# EAGLE board P1001-001-003-320 - Controller (EAGLE 9.4.2), part 1 of 3
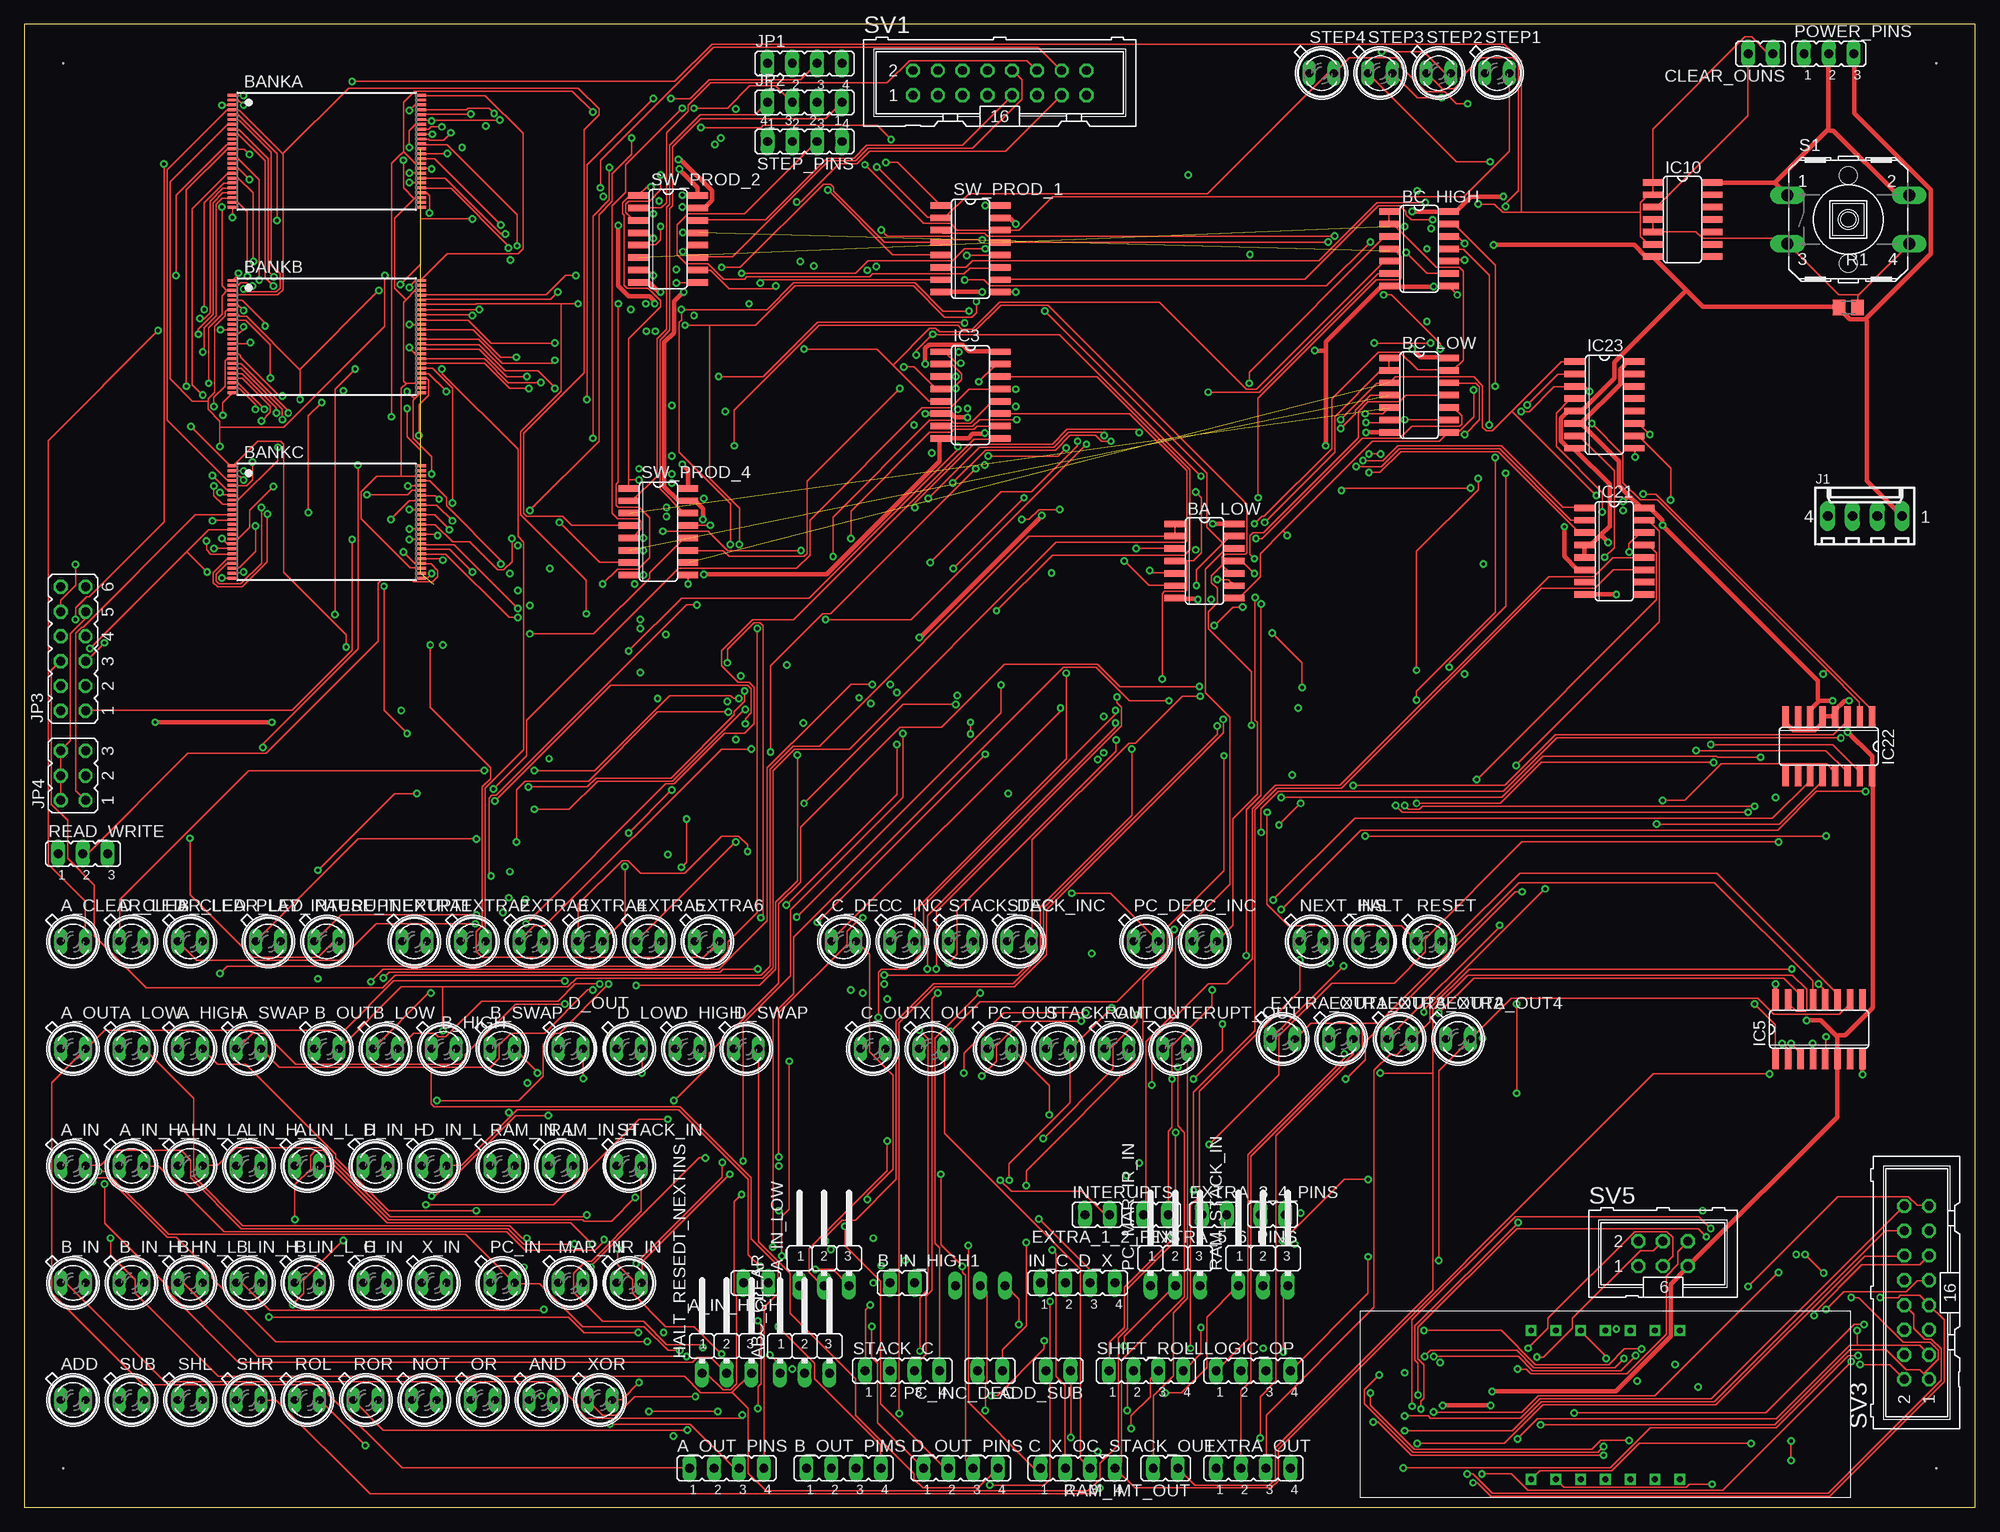
[diagram p5: board, top side]
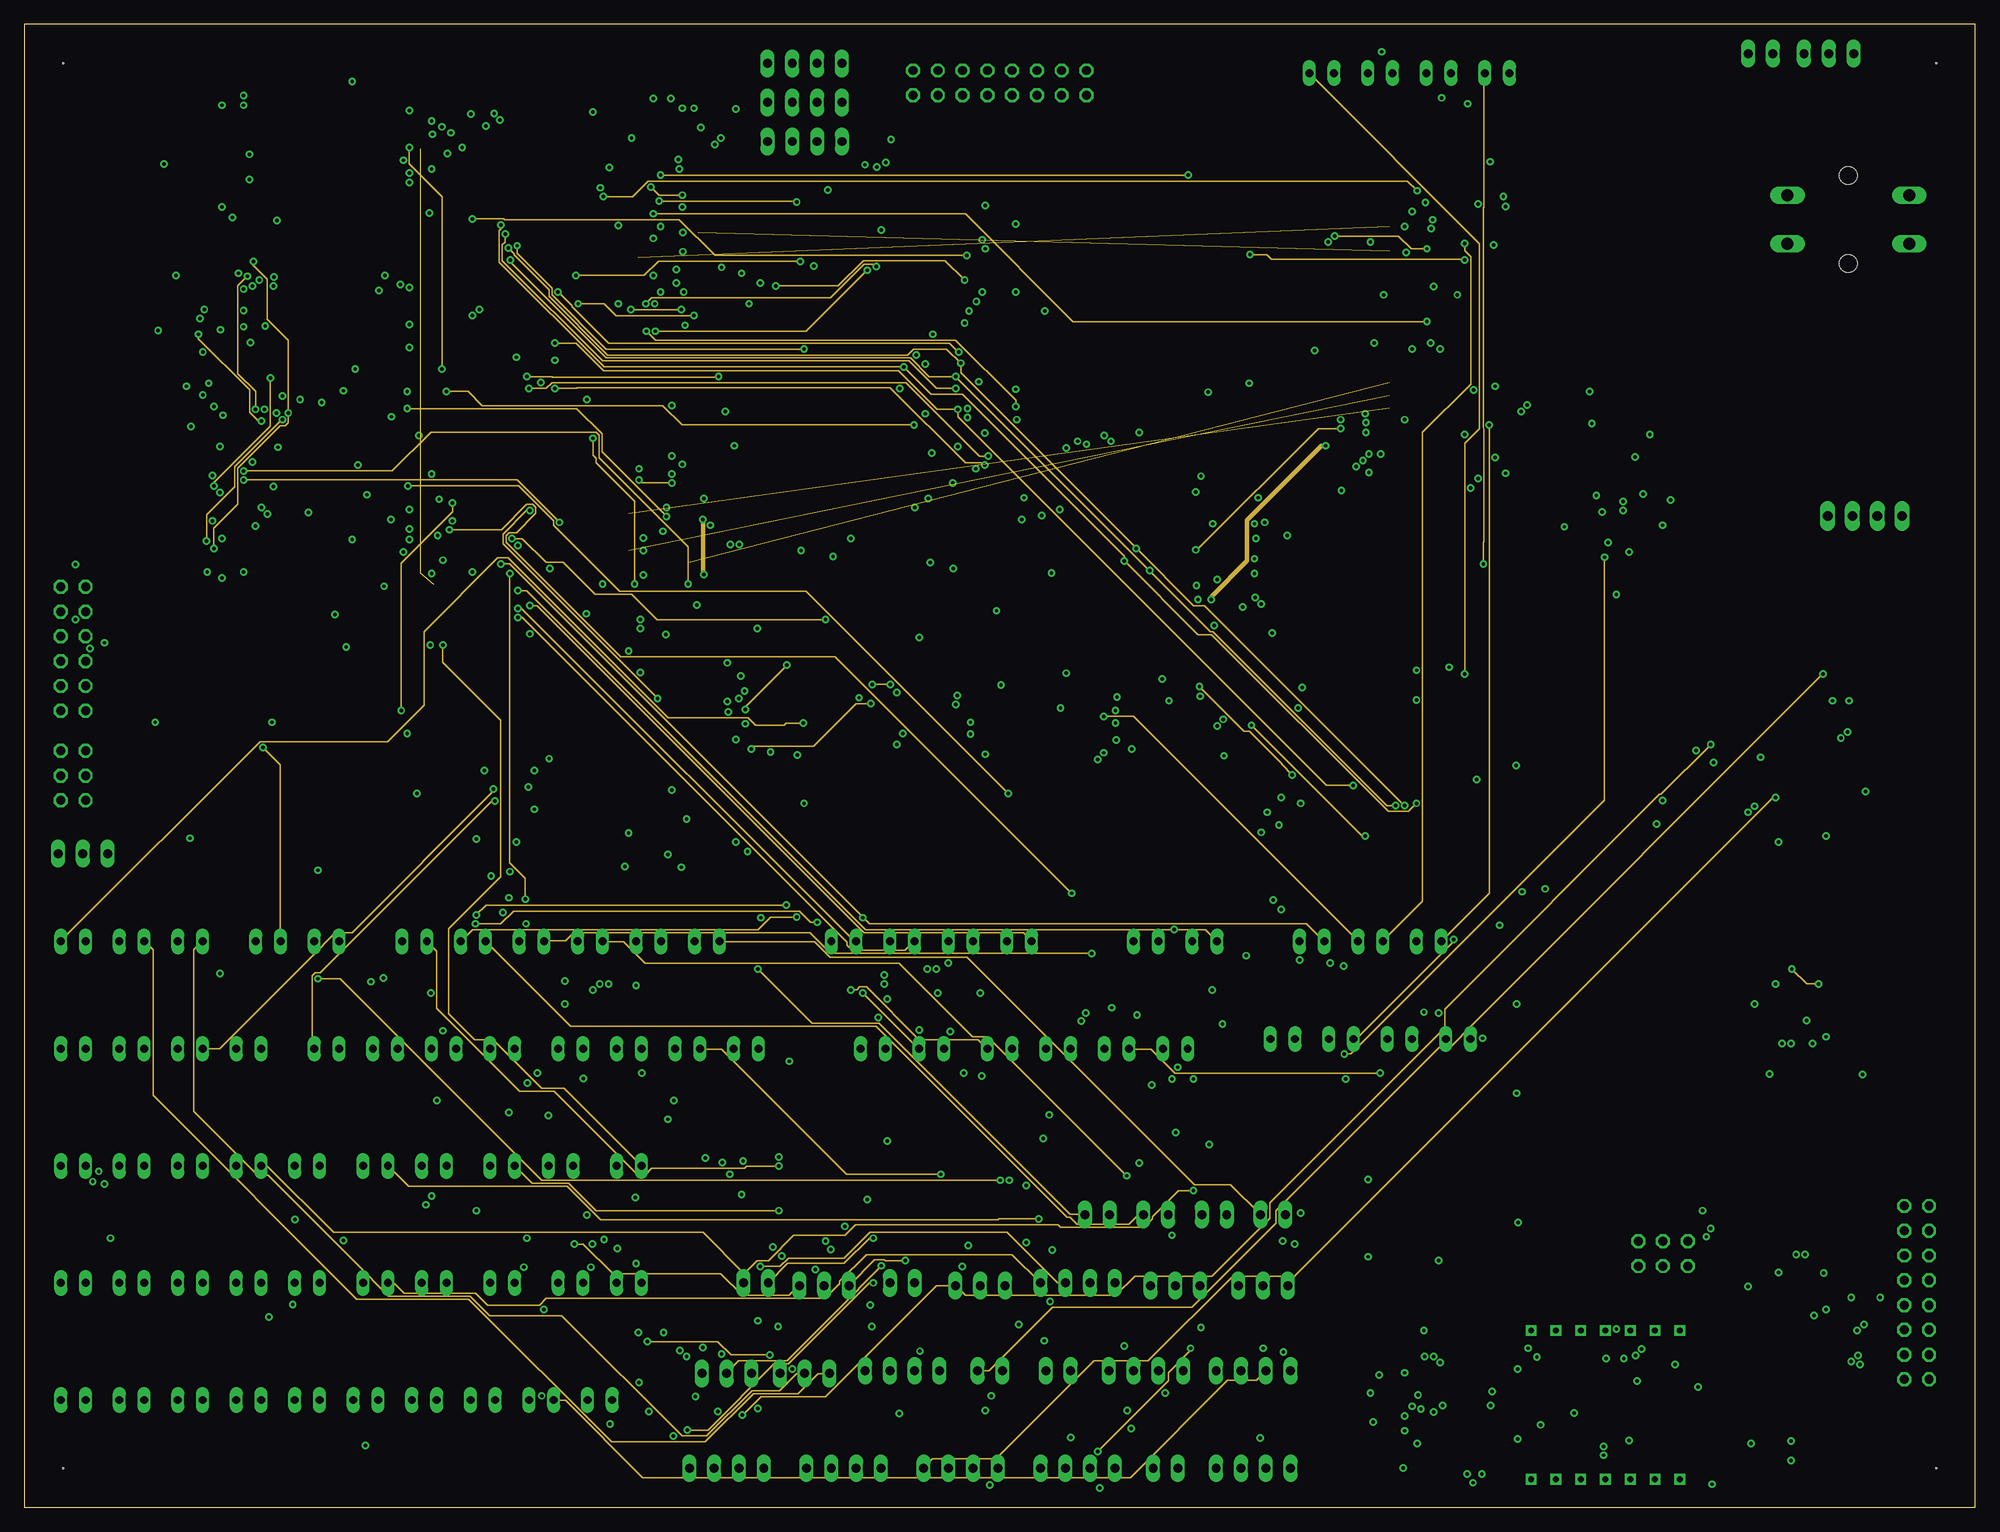
[diagram p6: board, inner layer Route2]
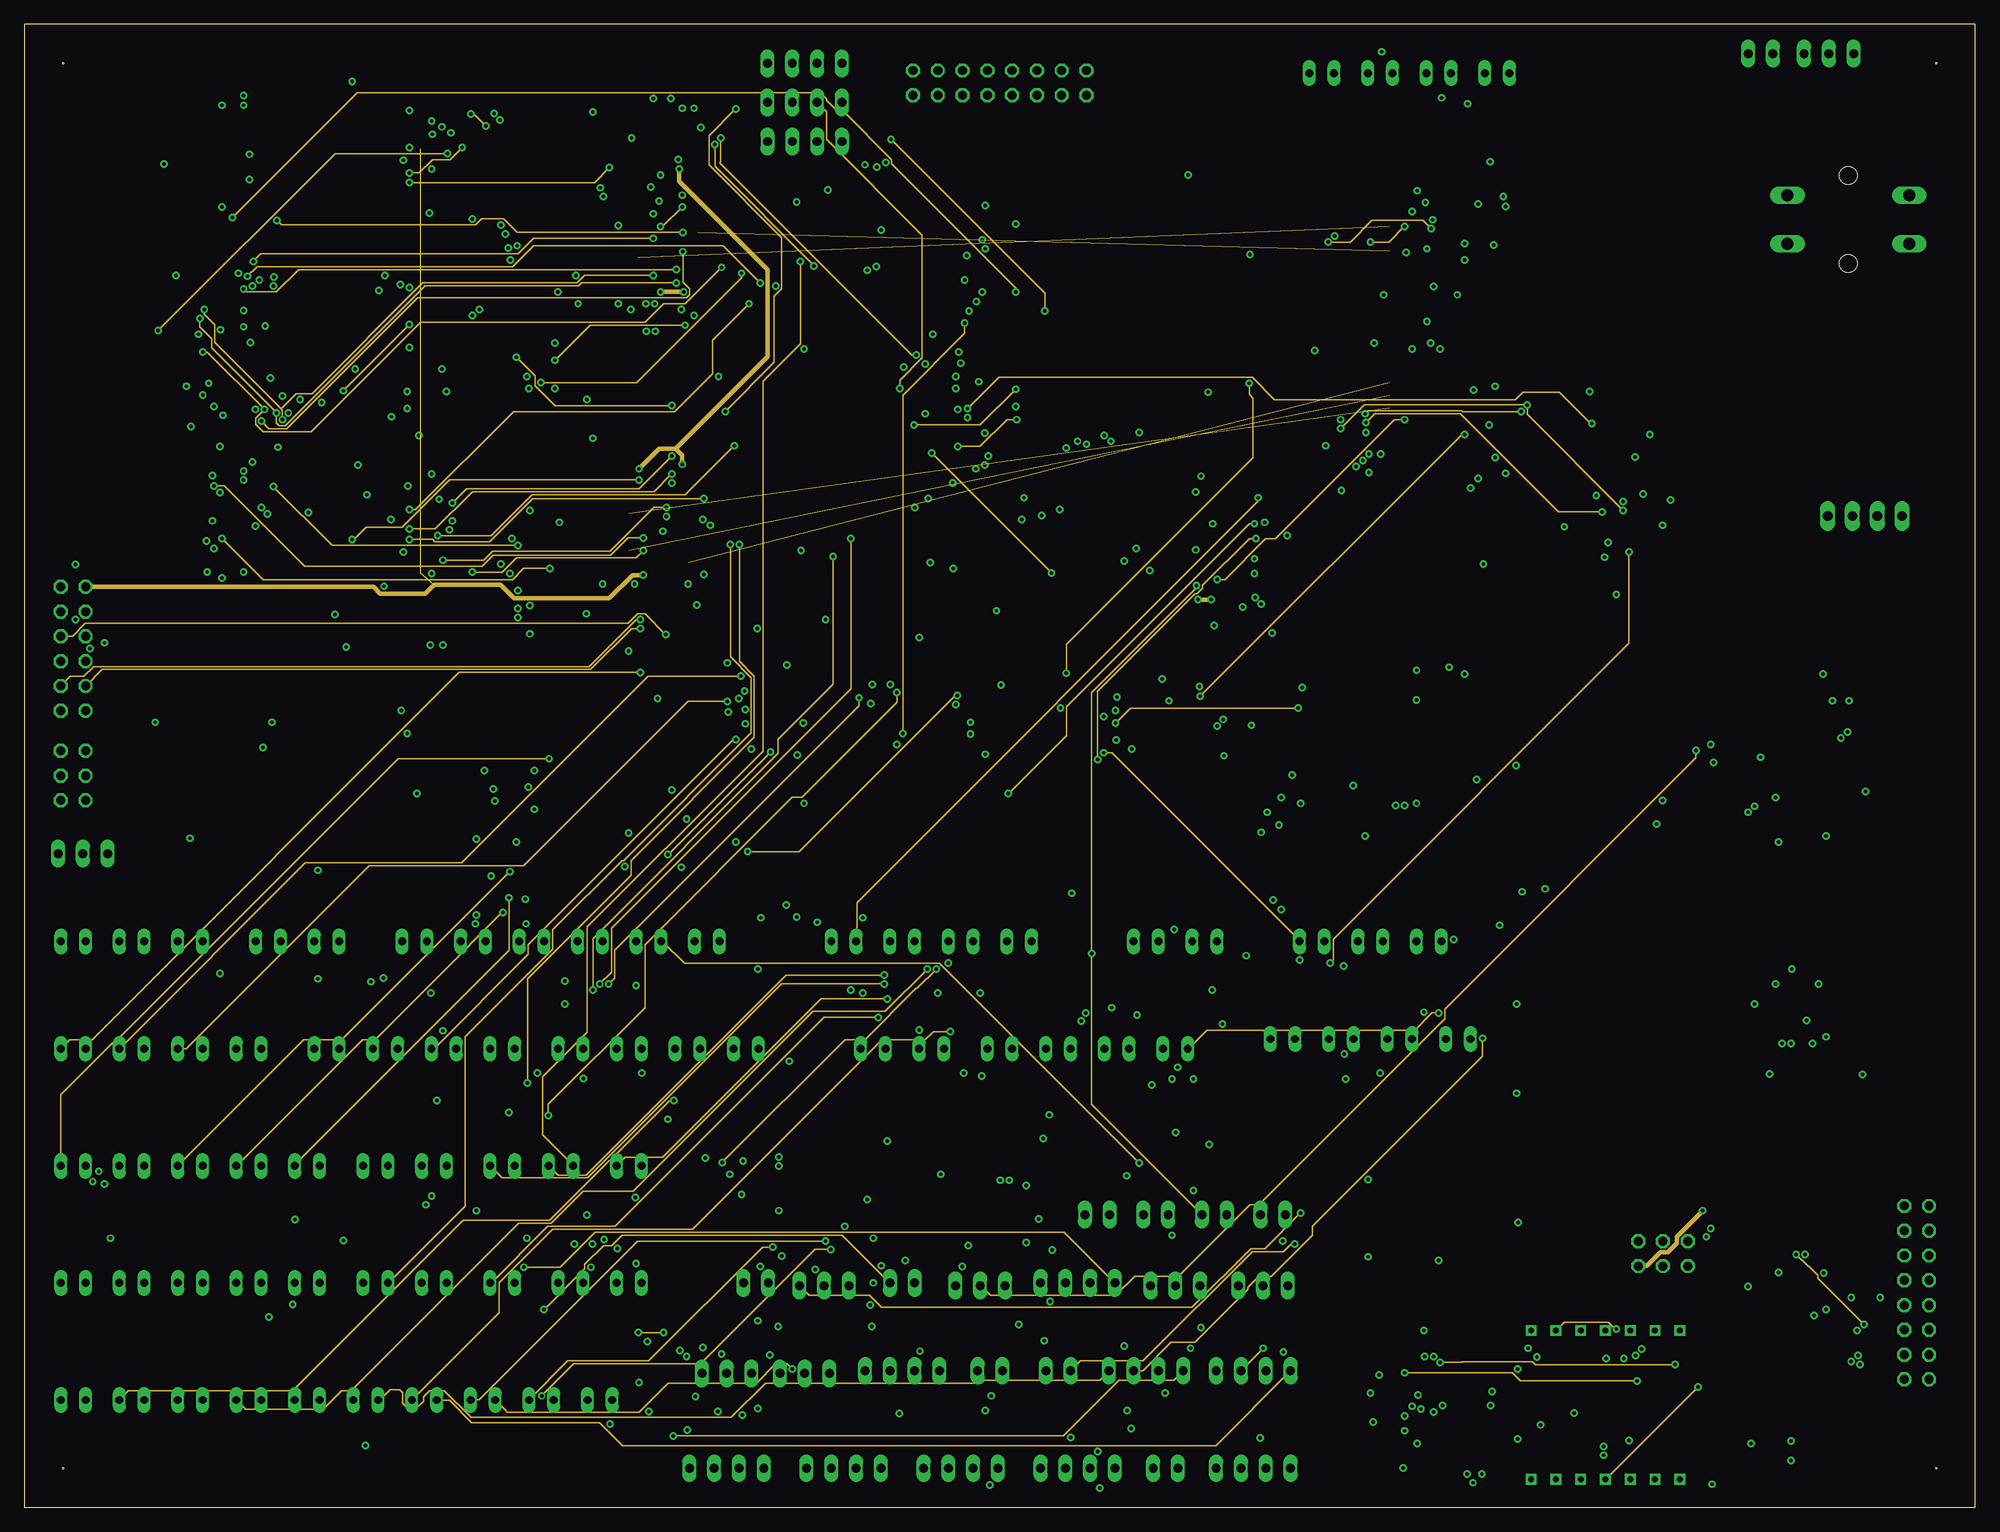
[diagram p7: board, inner layer Route15]
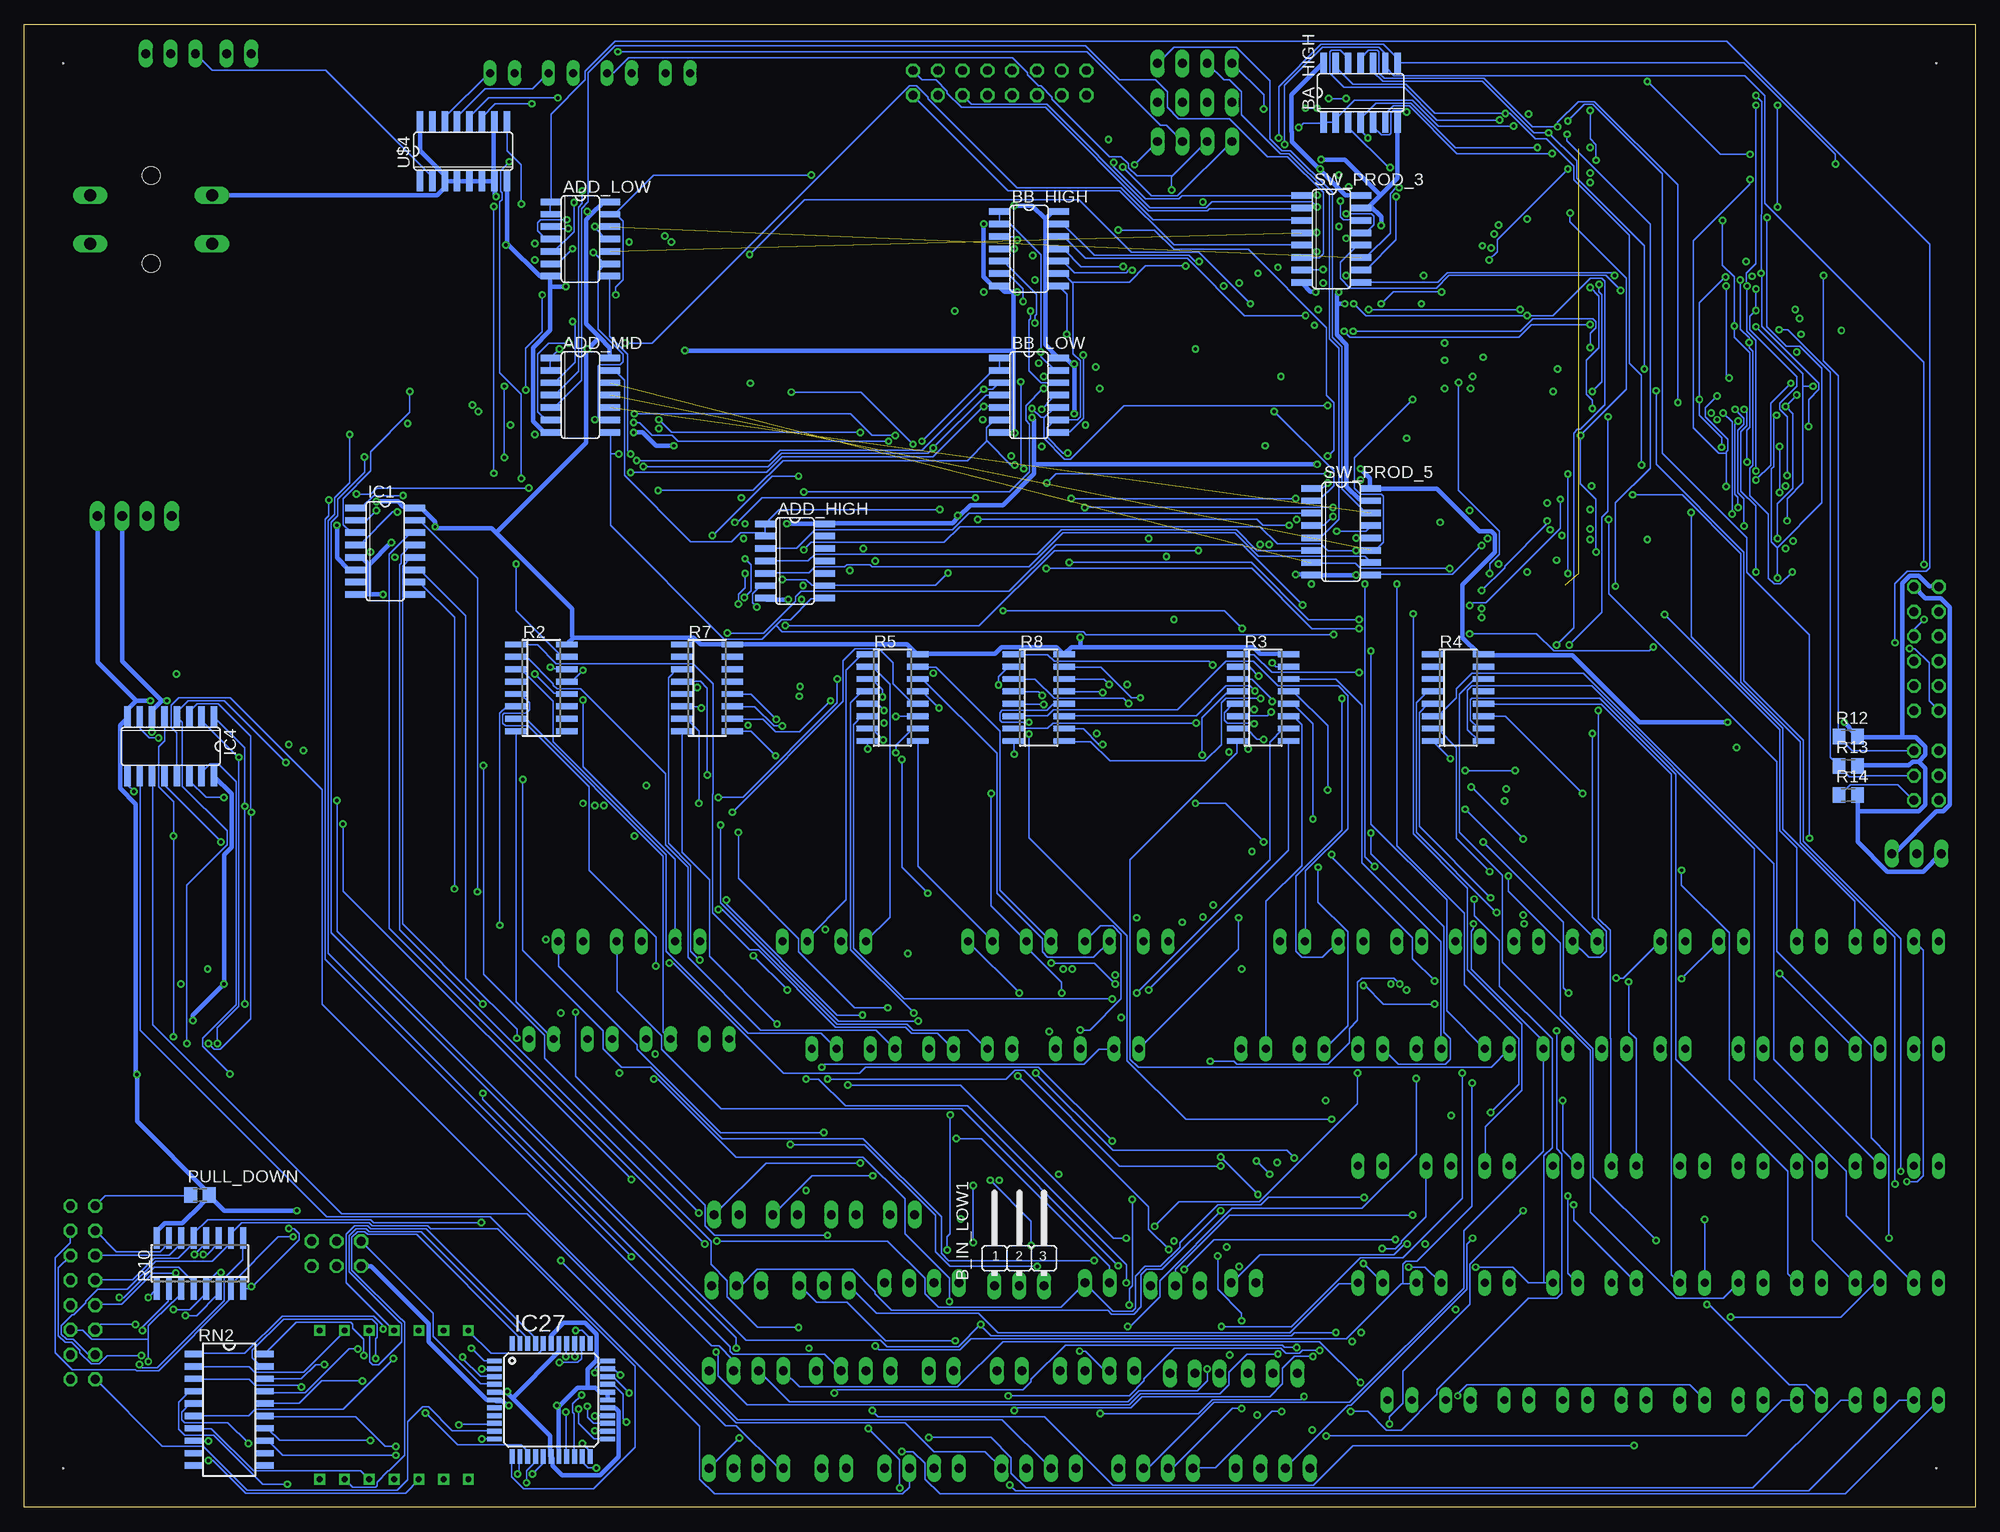
[diagram p8: board, bottom side, seen from below]

Size 200 x 152 mm. Coordinates in mm from the lower left corner, seen from the top.
Outline: 0,0 200,0 200,152 0,152 0,0
Copper layers (1+2*15+16): Top 0.035mm / dielectric 1.5mm / Route2 0.035mm / dielectric 0.15mm / Route15 0.035mm / dielectric 0.2mm / Bottom 0.035mm
Design rules "default *": minimum track width 6mil, minimum drill 0.35mm, track to track 6mil, track to pad 6mil, pad to pad 6mil, via to via 6mil, smd to smd 6mil, copper to edge 40mil, drill to drill 6mil, minimum pad ring 10mil, minimum via ring 8mil, stop-mask expansion 4mil, vias tented up to drill 0mil, thermal gap 10mil
Net classes: 1 power: width 0.457 mm
Holes 0.12 mm at 4,4 196,148 4,148 196,4

## Footprints (pad centres in the part's own frame; a part is rotated, then mirrored left to right if it is on the bottom)
SFH482 = drill 0.813 long: A -1.27,0; K 1.27,0
JP1 = drill 0.914 long: 1 0,-1.27; 2 0,1.27
JP2W = drill 0.914 long: 1 -2.54,-1.27; 2 0,-1.27; 3 2.54,-1.27
JP4 = drill 0.914 long: 1 -3.81,0; 2 -1.27,0; 3 1.27,0; 4 3.81,0
SO14 = smd 0.66 x 2.032: 1 -3.81,-3.073; 2 -2.54,-3.073; 3 -1.27,-3.073; 4 0,-3.073; 5 1.27,-3.073; 6 2.54,-3.073; 7 3.81,-3.073; 8 3.81,3.073; 9 2.54,3.073; 10 1.27,3.073; 11 0,3.073; 12 -1.27,3.073; 13 -2.54,3.073; 14 -3.81,3.073
TSOP48 = smd 1.1 x 0.3: 1 -9.625,5.75; 2 -9.625,5.25; 3 -9.625,4.75; 4 -9.625,4.25; 5 -9.625,3.75; 6 -9.625,3.25; 7 -9.625,2.75; 8 -9.625,2.25; 9 -9.625,1.75; 10 -9.625,1.25; 11 -9.625,0.75; 12 -9.625,0.25; 13 -9.625,-0.25; 14 -9.625,-0.75; 15 -9.625,-1.25; 16 -9.625,-1.75; 17 -9.625,-2.25; 18 -9.625,-2.75; 19 -9.625,-3.25; 20 -9.625,-3.75; 21 -9.625,-4.25; 22 -9.625,-4.75; 23 -9.625,-5.25; 24 -9.625,-5.75; 25 9.625,-5.75; 26 9.625,-5.25; 27 9.625,-4.75; 28 9.625,-4.25; 29 9.625,-3.75; 30 9.625,-3.25; 31 9.625,-2.75; 32 9.625,-2.25; 33 9.625,-1.75; 34 9.625,-1.25; 35 9.625,-0.75; 36 9.625,-0.25; 37 9.625,0.25; 38 9.625,0.75; 39 9.625,1.25; 40 9.625,1.75; 41 9.625,2.25; 42 9.625,2.75; 43 9.625,3.25; 44 9.625,3.75; 45 9.625,4.25; 46 9.625,4.75; 47 9.625,5.25; 48 9.625,5.75
SO16 = smd 0.66 x 2.032: 1 -4.445,-3.073; 2 -3.175,-3.073; 3 -1.905,-3.073; 4 -0.635,-3.073; 5 0.635,-3.073; 6 1.905,-3.073; 7 3.175,-3.073; 8 4.445,-3.073; 9 4.445,3.073; 10 3.175,3.073; 11 1.905,3.073; 12 0.635,3.073; 13 -0.635,3.073; 14 -1.905,3.073; 15 -3.175,3.073; 16 -4.445,3.073
TQFP44 = smd 1.5 x 0.5: 1 -5.8,4; 2 -5.8,3.2; 3 -5.8,2.4; 4 -5.8,1.6; 5 -5.8,0.8; 6 -5.8,0; 7 -5.8,-0.8; 8 -5.8,-1.6; 9 -5.8,-2.4; 10 -5.8,-3.2; 11 -5.8,-4; 23 5.8,-4; 24 5.8,-3.2; 25 5.8,-2.4; 26 5.8,-1.6; 27 5.8,-0.8; 28 5.8,0; 29 5.8,0.8; 30 5.8,1.6; 31 5.8,2.4; 32 5.8,3.2; 33 5.8,4 | smd 0.5 x 1.5: 12 -4,-5.8; 13 -3.2,-5.8; 14 -2.4,-5.8; 15 -1.6,-5.8; 16 -0.8,-5.8; 17 0,-5.8; 18 0.8,-5.8; 19 1.6,-5.8; 20 2.4,-5.8; 21 3.2,-5.8; 22 4,-5.8; 34 4,5.8; 35 3.2,5.8; 36 2.4,5.8; 37 1.6,5.8; 38 0.8,5.8; 39 0,5.8; 40 -0.8,5.8; 41 -1.6,5.8; 42 -2.4,5.8; 43 -3.2,5.8; 44 -4,5.8
6410-04 = drill 1.016 long: 1 3.81,0; 2 1.27,0; 3 -1.27,0; 4 -3.81,0
JP6Q = drill 0.914 octagon: 1 -6.35,-1.27; 2 -6.35,1.27; 3 -3.81,-1.27; 4 -3.81,1.27; 5 -1.27,-1.27; 6 -1.27,1.27; 7 1.27,-1.27; 8 1.27,1.27; 9 3.81,-1.27; 10 3.81,1.27; 11 6.35,-1.27; 12 6.35,1.27
JP3Q = drill 0.914 octagon: 1 -2.54,-1.27; 2 -2.54,1.27; 3 0,-1.27; 4 0,1.27; 5 2.54,-1.27; 6 2.54,1.27
JP2 = drill 0.914 long: 1 -2.54,0; 2 0,0; 3 2.54,0
M0805 = smd 1.3 x 1.6: 1 -0.95,0; 2 0.95,0
SO16' = smd 0.6 x 2.2: 1 -4.445,-2.6; 2 -3.175,-2.6; 3 -1.905,-2.6; 4 -0.635,-2.6; 5 0.635,-2.6; 6 1.905,-2.6; 7 3.175,-2.6; 8 4.445,-2.6; 9 4.445,2.6; 10 3.175,2.6; 11 1.905,2.6; 12 0.635,2.6; 13 -0.635,2.6; 14 -1.905,2.6; 15 -3.175,2.6; 16 -4.445,2.6
SOMC20 = smd 1.91 x 0.64: 1 -3.62,5.715; 2 -3.62,4.445; 3 -3.62,3.175; 4 -3.62,1.905; 5 -3.62,0.635; 6 -3.62,-0.635; 7 -3.62,-1.905; 8 -3.62,-3.175; 9 -3.62,-4.445; 10 -3.62,-5.715; 11 3.62,-5.715; 12 3.62,-4.445; 13 3.62,-3.175; 14 3.62,-1.905; 15 3.62,-0.635; 16 3.62,0.635; 17 3.62,1.905; 18 3.62,3.175; 19 3.62,4.445; 20 3.62,5.715
B3F-40XX = drill 1.194 long: 1 -6.248,2.489; 2 6.248,2.489; 3 -6.248,-2.489; 4 6.248,-2.489 | hole 1.803: 0,-4.496; 0,4.496
ML16 = drill 0.914 octagon: 1 -8.89,-1.27; 2 -8.89,1.27; 3 -6.35,-1.27; 4 -6.35,1.27; 5 -3.81,-1.27; 6 -3.81,1.27; 7 -1.27,-1.27; 8 -1.27,1.27; 9 1.27,-1.27; 10 1.27,1.27; 11 3.81,-1.27; 12 3.81,1.27; 13 6.35,-1.27; 14 6.35,1.27; 15 8.89,-1.27; 16 8.89,1.27
ML6 = drill 0.914 octagon: 1 -2.54,-1.27; 2 -2.54,1.27; 3 0,-1.27; 4 0,1.27; 5 2.54,-1.27; 6 2.54,1.27
4-DIGIT-7-SEGMENT = drill 0.6 square: PIN1 17.48,1.88; PIN2 20.02,1.88; PIN3 22.56,1.88; PIN4 25.1,1.88; PIN5 27.64,1.88; PIN6 30.18,1.88; PIN7 32.72,1.88; PIN8 32.72,17.12; PIN9 30.18,17.12; PIN10 27.64,17.12; PIN11 25.1,17.12; PIN12 22.56,17.12; PIN13 20.02,17.12; PIN14 17.48,17.12

## Placement (x,y rotation side)
A_CLEAR_LED  [SFH482]  5,58 0 top
A_HIGH  [SFH482]  17,47 0 top
A_IN  [SFH482]  5,35 0 top
A_IN_H_H  [SFH482]  11,35 0 top
A_IN_H_L  [SFH482]  23,35 0 top
A_IN_HIGH  [JP1]  75,23 90 top
A_IN_L_H  [SFH482]  29,35 0 top
A_IN_L_L  [SFH482]  17,35 0 top
A_IN_LOW  [JP2W]  82,24 0 top
A_LOW  [SFH482]  11,47 0 top
A_OUT  [SFH482]  5,47 0 top
A_OUT_PINS  [JP4]  72,4 0 top
A_SWAP  [SFH482]  23,47 0 top
ABC_CLEAR  [JP2W]  80,15 0 top
ADD  [SFH482]  5,11 0 top
ADD_HIGH  74ABT164D  [SO14]  121,97 270 bottom
ADD_LOW  74ABT164D  [SO14]  143,130 270 bottom
ADD_MID  74ABT164D  [SO14]  143,114 270 bottom
ADD_SUB  [JP1]  106,14 90 top
AND  [SFH482]  53,11 0 top
B_CLEAR_LED  [SFH482]  17,58 0 top
B_HIGH  [SFH482]  43,47 0 top
B_IN  [SFH482]  5,23 0 top
B_IN_H_H  [SFH482]  11,23 0 top
B_IN_H_L  [SFH482]  23,23 0 top
B_IN_HIGH1  [JP1]  90,23 270 top
B_IN_L_H  [SFH482]  29,23 0 top
B_IN_L_L  [SFH482]  17,23 0 top
B_IN_LOW1  [JP2W]  98,24 0 bottom
B_LOW  [SFH482]  37,47 0 top
B_OUT  [SFH482]  31,47 0 top
B_OUT_PIMS  [JP4]  84,4 0 top
B_SWAP  [SFH482]  49,47 0 top
BA_HIGH  74ABT164D  [SO14]  63,145 0 bottom
BA_LOW  74ABT164D  [SO14]  121,97 270 top
BANKA  SST39VF1602-70-4I-EKE  [TSOP48]  31,139 0 top
BANKB  SST39VF1602-70-4I-EKE  [TSOP48]  31,120 0 top
BANKC  SST39VF1602-70-4I-EKE  [TSOP48]  31,101 0 top
BB_HIGH  74ABT164D  [SO14]  97,129 270 bottom
BB_LOW  74ABT164D  [SO14]  97,114 270 bottom
BC_HIGH  74ABT164D  [SO14]  143,129 270 top
BC_LOW  74ABT164D  [SO14]  143,114 270 top
C_DEC  [SFH482]  84,58 0 top
C_IN  [SFH482]  36,23 0 top
C_INC  [SFH482]  90,58 0 top
C_OUT  [SFH482]  87,47 0 top
C_X_OC_STACK_OUT  [JP4]  108,4 0 top
CLEAR_OUNS  [JP1]  178,149 90 top
D_CLEAR_LED  [SFH482]  11,58 0 top
D_HIGH  [SFH482]  68,47 0 top
D_IN_H  [SFH482]  36,35 0 top
D_IN_L  [SFH482]  42,35 0 top
D_LOW  [SFH482]  62,47 0 top
D_OUT  [SFH482]  56,47 0 top
D_OUT_PINS  [JP4]  96,4 0 top
D_SWAP  [SFH482]  74,47 0 top
EXTRA1  [SFH482]  40,58 0 top
EXTRA2  [SFH482]  46,58 0 top
EXTRA3  [SFH482]  52,58 0 top
EXTRA4  [SFH482]  58,58 0 top
EXTRA5  [SFH482]  64,58 0 top
EXTRA6  [SFH482]  70,58 0 top
EXTRA_1_2_PINS  [JP1]  116,30 90 top
EXTRA_3_4_PINS  [JP1]  122,30 270 top
EXTRA_5_6_PINS  [JP1]  128,30 90 top
EXTRA_OUT  [JP4]  126,4 0 top
EXTRA_OUT1  [SFH482]  129,48 0 top
EXTRA_OUT2  [SFH482]  141,48 0 top
EXTRA_OUT3  [SFH482]  135,48 0 top
EXTRA_OUT4  [SFH482]  147,48 0 top
HALT  [SFH482]  138,58 0 top
HALT_RESEDT_NEXTINS  [JP2W]  72,15 0 top
IC1  74LS138D  [SO16]  163,98 270 bottom
IC3  74LS138D  [SO16]  97,114 270 top
IC4  74LS138D  [SO16]  185,78 180 bottom
IC5  74LS138D  [SO16]  184,49 0 top
IC10  74ALS00D  [SO14]  170,132 270 top
IC21  74LS138D  [SO16]  163,98 270 top
IC22  74LS138D  [SO16]  185,78 180 top
IC23  74LS138D  [SO16]  162,113 270 top
IC27  MEGA8535-A  [TQFP44]  146,11 0 bottom
IN_C_D_X  [JP4]  108,23 0 top
INTERUPT_OUT  [SFH482]  118,47 0 top
INTERUPTS  [JP1]  110,30 270 top
IR_IN  [SFH482]  62,23 0 top
J1  22-27-2041-04  [6410-04]  188.7,101.61 0 top
JP1  [JP4]  80,148 0 top
JP2  [JP4]  80,144 0 top
JP3  [JP6Q]  5,88 90 top
JP4  [JP3Q]  5,75 90 top
LOGIC_OP  [JP4]  126,14 0 top
MAR_IN  [SFH482]  56,23 0 top
NEXT_INS  [SFH482]  132,58 0 top
NOT  [SFH482]  41,11 0 top
OR  [SFH482]  47,11 0 top
PAUSE_INERUPT  [SFH482]  31,58 0 top
PC_DEC  [SFH482]  115,58 0 top
PC_IN  [SFH482]  49,23 0 top
PC_INC  [SFH482]  121,58 0 top
PC_INC_DEC  [JP1]  99,14 90 top
PC_MAR_IR_IN  [JP2W]  118,24 0 top
PC_OUT  [SFH482]  100,47 0 top
PLAY_INTERUPT  [SFH482]  25,58 0 top
POWER_PINS  [JP2]  185,149 0 top
PULL_DOWN  [M0805]  182,32 0 bottom
R1  [M0805]  187,123 0 top
R2  [SO16']  147,84 270 bottom
R3  [SO16']  73,83 270 bottom
R4  [SO16']  53,83 270 bottom
R5  [SO16']  111,83 270 bottom
R7  [SO16']  130,84 270 bottom
R8  [SO16']  96,83 270 bottom
R10  [SO16']  182,25 0 bottom
R12  [M0805]  13,79 0 bottom
R13  [M0805]  13,76 0 bottom
R14  [M0805]  13,73 0 bottom
RAM_IMT_OUT  [JP1]  117,4 90 top
RAM_IN_H  [SFH482]  55,35 0 top
RAM_IN_L  [SFH482]  49,35 0 top
RAM_OUT  [SFH482]  112,47 0 top
RAM_STACK_IN  [JP2W]  127,24 0 top
READ_WRITE  [JP2]  6,67 0 top
RESET  [SFH482]  144,58 0 top
RN2  [SOMC20]  179,10 0 bottom
ROL  [SFH482]  29,11 0 top
ROR  [SFH482]  35,11 0 top
S1  [B3F-40XX]  187,132 0 top
SHIFT_ROLL  [JP4]  115,14 0 top
SHL  [SFH482]  17,11 0 top
SHR  [SFH482]  23,11 0 top
STACK_C  [JP4]  90,14 0 top
STACK_DEC  [SFH482]  96,58 0 top
STACK_IN  [SFH482]  62,35 0 top
STACK_INC  [SFH482]  102,58 0 top
STACK_OUT  [SFH482]  106,47 0 top
STEP1  [SFH482]  151,147 0 top
STEP2  [SFH482]  145,147 0 top
STEP3  [SFH482]  139,147 0 top
STEP4  [SFH482]  133,147 0 top
STEP_PINS  [JP4]  80,140 180 top
SUB  [SFH482]  11,11 0 top
SV1  [ML16]  100,146 0 top
SV3  [ML16]  194,22 90 top
SV5  [ML6]  168,26 0 top
SW_PROD_1  74LS157D  [SO16]  97,129 270 top
SW_PROD_2  74LS157D  [SO16]  66,130 270 top
SW_PROD_3  74LS157D  [SO16]  66,130 270 bottom
SW_PROD_4  74LS157D  [SO16]  65,100 270 top
SW_PROD_5  74LS157D  [SO16]  65,100 270 bottom
U$1  4-DIGIT-7-SEGMENT  [4-DIGIT-7-SEGMENT]  137,1 0 top
U$4  SN74HC161  [SO16]  155,139 0 bottom
X_IN  [SFH482]  42,23 0 top
X_OUT  [SFH482]  93,47 0 top
XOR  [SFH482]  59,11 0 top

## Tracks (layer width: path | path; a pad name or v marks a point on that pad's centre or on a via)
!CLEAR  (via drill 0.35)
  Top 0.152: v19.28,101.12 19.36,101.19 21.34,101.19 BANKC.12 | v22.48,121.01 22.48,120.78 22.02,120.32 21.41,120.32 BANKB.12 | v16.61,114.91 16.61,135.03 20.8,139.22 21.34,139.22 BANKA.12 21.41,139.22 22.55,139.22 v23.09,138.68 | 165.66,132.74 165.66,133.73 166.42,134.49 166.88,134.49 IC10.2 166.95,134.57 166.95,135.79 IC10.1 166.95,135.87 166.95,141.28 176.4,150.72 177.09,150.72 178.76,149.05 179.22,149.05 CLEAR_OUNS.1 | 165.66,132.74 165.66,130.3 166.5,129.46 166.88,129.46 IC10.6 | v149.05,133.58 150.72,133.58 151.56,132.74 153.47,132.74 | 165.66,132.74 153.47,132.74 | v33.6,146.15 66.67,146.15 70.48,149.96 151.71,149.96 153.47,148.21 153.47,132.74
  Bottom 0.152: v19.28,101.12 19.28,103.4 17.68,105 17.68,114.91 | 17.68,114.91 17.68,116.2 v22.48,121.01 | 17.68,114.91 v16.61,114.91 | v149.05,133.58 149.05,137.62 150.5,139.06 150.5,142.04 U$4.9 | v23.09,138.68 26.14,138.68 v33.6,146.15
A  (via drill 0.35)
  Top 0.152: v144.47,15.47 153.16,15.47 154.61,14.02 163.68,14.02 v165.2,15.54
  Bottom 0.152: v144.47,15.47 144.47,16.76 IC27.37 | v165.2,15.54 165.2,17.22 166.34,18.36 166.34,18.75 166.57,18.97 172.14,18.97 175.34,15.77 RN2.20
ADDR_BUS0  (via drill 0.35)
  Top 0.152: BANKC.25 41.3,95.25 v41.76,95.71 | v41.76,105.92 41.76,107.67 39.85,109.58 39.85,113.46 40.01,113.61 | 40.01,113.61 40.62,114.22 BANKB.25 | 40.62,132.06 40.62,127.41 v38.56,125.35 | 40.62,132.06 40.62,133.2 BANKA.25 | 40.01,113.61 v39.24,114.38 | v96.62,128.32 100.05,128.32 SW_PROD_1.12 | 40.62,132.06 v45.95,132.06
  Route2 0.152: v96.62,128.32 70.79,128.32 67.13,131.98 49.23,131.98 49.15,132.06 v45.95,132.06
  Bottom 0.152: v41.76,105.92 v41.76,95.71 | v38.56,125.35 38.56,124.59 38.25,124.28 38.25,115.37 v39.24,114.38
ADDR_BUS1  (via drill 0.35)
  Top 0.152: v20.27,95.25 BANKC.24 | v20.34,111.94 20.34,113.23 21.34,114.22 BANKB.24 | v21.34,132.21 21.34,133.2 BANKA.24 | v101.65,124.59 100.13,124.59 SW_PROD_1.9
  Route15 0.152: v101.65,124.59 101.65,124.97 88.92,137.69 88.92,138.15 84.05,143.03 83.44,143.03 82.22,144.25 82.22,144.4 81.61,145.01 34.14,145.01 v21.34,132.21
  Bottom 0.152: 20.27,98.37 v20.27,95.25 | 20.27,98.37 20.88,98.98 20.88,106.45 20.65,106.68 20.65,111.63 v20.34,111.94 | v21.34,132.21 21.34,121.01 19.36,119.02 17.98,119.02 15.7,116.74 15.7,102.95 20.27,98.37
ADDR_BUS2  (via drill 0.35)
  Top 0.152: v22.48,95.86 22.4,95.78 21.41,95.78 BANKC.23 | v23.7,112.55 23.7,113 22.02,114.68 21.41,114.68 BANKB.23 | v22.86,126.19 22.86,132.82 21.95,133.73 21.41,133.73 BANKA.23 | v75.44,125.5 75.74,125.81 93.88,125.81 SW_PROD_1.7
  Route2 0.152: v22.86,126.19 21.87,125.2 21.87,116.2 23.7,114.38 v23.7,112.55
  Route15 0.152: v75.44,125.5 71.63,129.31 52.2,129.31 50.06,127.18 23.85,127.18 v22.86,126.19
  Bottom 0.152: v22.48,95.86 22.48,102.64 24,104.17 24,110.26 23.39,110.87 23.39,112.24 v23.7,112.55
ADDR_BUS3  (via drill 0.35)
  Top 0.152: v23.7,100.58 23.7,97.99 22.02,96.32 21.41,96.32 BANKC.22 | v24.61,112.55 21.95,115.21 21.41,115.21 BANKB.22 | v18.29,118.42 18.44,118.57 18.44,120.93 19.66,122.15 19.66,133.58 20.27,134.19 21.34,134.19 BANKA.22 | v71.48,127.1 73.38,127.1 81.92,135.64 82.68,135.64 82.98,135.33 82.98,134.87 88.16,129.69 93.88,129.69 SW_PROD_1.4
  Route15 0.152: v18.29,118.42 18.75,118.42 v24.61,112.55 23.7,111.63 23.7,111.02 24.46,110.26 29.41,110.26 40.62,121.46 63.63,121.46 65.53,123.37 67.74,123.37 v71.48,127.1
  Bottom 0.152: v23.7,100.58 23.7,103.4 24.31,104.01 24.31,110.41 23.7,111.02 23.7,111.63 v24.61,112.55
ADDR_BUS4  (via drill 0.35)
  Top 0.152: v24.31,102.49 24.31,96.77 22.17,94.64 19.96,94.64 19.66,94.94 19.66,95.63 20.73,96.7 21.34,96.7 BANKC.21 | v24.31,111.33 25.22,112.24 25.22,112.85 22.33,115.75 21.41,115.75 BANKB.21 | v17.83,120.24 17.83,120.78 19.36,122.3 19.36,133.73 20.34,134.72 21.34,134.72 BANKA.21 | v67.51,128.7 68.12,129.31 69.04,129.31 SW_PROD_2.12
  Route2 0.152: v17.83,120.24 17.83,119.79 23.09,114.53 23.09,112.24 24,111.33 v24.31,111.33
  Route15 0.152: v67.51,128.7 67.51,125.58 68.2,124.89 68.2,124.28 67.89,123.98 40.31,123.98 26.9,110.57 25.07,110.57 v24.31,111.33
  Bottom 0.152: v24.31,102.49 24.31,103.56 24.61,103.86 24.61,111.02 v24.31,111.33
ADDR_BUS5  (via drill 0.35)
  Top 0.152: v24.92,101.8 24.92,96.93 22.33,94.34 19.81,94.34 19.36,94.79 19.36,95.78 20.8,97.23 21.34,97.23 BANKC.20 | v25.83,112.17 25.83,112.7 22.33,116.2 21.41,116.2 BANKB.20 | v17.98,121.84 18.44,121.84 19.05,122.45 19.05,133.88 20.34,135.18 21.34,135.18 BANKA.20 | v66.83,125.5 69.04,125.5 SW_PROD_2.9
  Route15 0.152: v17.98,121.84 17.98,121.01 19.2,119.79 19.2,118.87 25.83,112.24 v25.83,112.17 25.83,111.18 26.14,110.87 26.75,110.87 41.07,125.2 56.84,125.2 57.15,125.5 v66.83,125.5
  Bottom 0.152: v24.92,101.8 24.92,111.25 v25.83,112.17
ADDR_BUS6  (via drill 0.35)
  Top 0.152: v18.67,99.06 18.67,98.15 19.13,97.69 21.34,97.69 BANKC.19 | v26.44,111.48 26.44,112.55 22.25,116.74 21.41,116.74 BANKB.19 | v18.44,122.76 18.44,133.73 20.42,135.71 21.34,135.71 BANKA.19 | v64.47,126.26 63.93,126.8 62.94,126.8 SW_PROD_2.7
  Route2 0.152: v18.67,99.06 18.67,101.73 21.57,104.62 21.57,106.68 26.36,111.48 v26.44,111.48
  Route15 0.152: v18.44,122.76 18.44,122.3 19.51,121.23 19.51,119.41 26.33,112.58 | 26.33,112.58 26.44,112.47 v26.44,111.48 | v64.47,126.26 57.45,126.26 56.69,125.5 40.84,125.5 29.49,114.15 27.89,114.15 26.33,112.58
ADDR_BUS7  (via drill 0.35)
  Top 0.152: v19.43,98.3 21.34,98.3 BANKC.18 | v27.05,112.17 27.05,112.39 22.25,117.2 21.41,117.2 BANKB.18 | v23.47,127.71 23.47,134.72 21.95,136.25 21.41,136.25 BANKA.18 | v64.47,130.07 63.93,130.61 62.94,130.61 SW_PROD_2.4
  Route2 0.152: v19.43,98.3 19.43,100.36 21.87,102.79 21.87,106.53 26.21,110.87 26.75,110.87 27.05,111.18 v27.05,112.17 27.05,119.63 24.92,121.77 24.92,125.88 23.47,127.33 v23.47,127.71
  Route15 0.152: v64.47,130.07 52.2,130.07 50.6,128.47 24.23,128.47 v23.47,127.71
ADDR_BUS8  (via drill 0.35)
  Top 0.152: v25.98,108.66 25.98,107.29 21.95,103.25 21.41,103.25 BANKC.8 | v28.27,113.54 28.27,116.59 28.23,116.62 | 28.23,116.62 22.78,122.07 22.1,122.07 21.95,122.22 21.41,122.22 BANKB.8 | v25.6,126.11 24.99,126.72 24.99,138.23 22.02,141.2 21.41,141.2 BANKA.8 | 28.23,116.62 v36.35,124.74
  Bottom 0.152: v25.98,108.66 25.98,109.65 28.27,111.94 v28.27,113.54 28.27,123.44 v25.6,126.11 | v36.35,124.74 37.87,126.26 53.95,126.26 55.24,124.97 64.08,124.97 65.08,125.96 65.08,127.64 63.4,129.31 62.94,129.31 SW_PROD_3.12
ADDR_BUS9  (via drill 0.35)
  Top 0.152: v20.04,104.01 20.27,103.78 21.34,103.78 BANKC.7 | 20.04,110.72 20.04,111.33 18.82,112.55 18.82,113.39 | 20.04,110.72 v20.04,108.74 | 18.82,113.39 18.82,113.61 19.51,114.3 19.51,121.08 20.57,122.15 20.57,122.53 20.73,122.68 21.34,122.68 BANKB.7 | 18.82,113.39 17.22,113.39 14.94,115.67 14.94,135.87 20.8,141.73 21.34,141.73 BANKA.7 | v36.96,126.26 36.96,121.08 26.59,110.72 20.04,110.72
  Bottom 0.152: v20.04,108.74 v20.04,104.01 | v36.96,126.26 37.26,126.57 54.1,126.57 55.09,125.58 62.87,125.58 SW_PROD_3.9
ADDR_BUS10  (via drill 0.35)
  Top 0.152: v19.28,105.77 20.73,104.32 21.34,104.32 BANKC.6 | v22.48,122.68 21.95,123.22 21.41,123.22 BANKB.6 | v22.48,124.89 22.78,124.59 25.83,124.59 26.21,124.97 26.21,126.42 25.3,127.33 25.3,138.91 22.02,142.19 21.41,142.19 BANKA.6
  Route15 0.152: v66.83,126.87 28.12,126.87 25.83,124.59 22.78,124.59 v22.48,124.89
  Bottom 0.152: v19.28,105.77 19.28,111.78 20.04,112.55 20.04,113.16 18.29,114.91 18.29,115.9 23.09,120.7 23.09,122.07 v22.48,122.68 v22.48,124.89 | v66.83,126.87 69.04,126.87 SW_PROD_3.7
ADDR_BUS11  (via drill 0.35)
  Top 0.152: v23.39,107.14 23.39,105.31 22.78,104.7 21.41,104.7 BANKC.5 | v24.69,121.08 24.69,121.39 22.33,123.75 21.41,123.75 BANKB.5 | v25.91,131.9 25.91,138.76 21.95,142.72 21.41,142.72 BANKA.5
  Route15 0.152: v67.51,130.68 50.52,130.68 49.15,132.06 46.86,132.06 46.25,131.44 26.36,131.44 v25.91,131.9
  Bottom 0.152: v23.39,107.14 23.39,110.41 23.09,110.72 23.09,118.34 24.69,119.94 v24.69,121.08 24.69,126.11 25.91,127.33 v25.91,131.9 | v67.51,130.68 69.04,130.68 SW_PROD_3.4
ADDR_BUS12
  Top 0.152: BANKC.4 21.34,105.31 20.73,105.31 14.63,111.4 14.63,137.08 20.73,143.18 21.34,143.18 BANKA.4 21.41,143.18 22.02,143.18 26.48,138.72 | 26.48,138.72 26.52,138.68 26.52,124.82 25.98,124.28 21.41,124.28 BANKB.4 | 26.48,138.72 33.22,145.47 56.77,145.47 58.9,143.33 58.9,142.72 57.38,141.2 57.38,116.28 51.21,110.11 51.21,101.88 51.51,101.58 55.17,101.58 56.08,100.66 61.87,100.66 SW_PROD_4.4
ADDR_BUS13  (via drill 0.35)
  Top 0.152: v22.48,105.31 22.1,105.69 21.41,105.69 BANKC.3 | v18.9,115.21 18.9,120.93 20.27,122.3 20.27,124.21 20.77,124.7 | 20.77,124.7 20.8,124.74 21.34,124.74 BANKB.3 | v20.27,143.71 21.34,143.71 BANKA.3 | v20.27,133.27 20.27,125.2 20.77,124.7 | v54.86,100.97 58.98,96.85 61.87,96.85 SW_PROD_4.7
  Route2 0.152: v54.86,100.97 50.52,105.31 v22.48,105.31
  Bottom 0.152: v22.48,105.31 20.95,106.83 20.95,113.16 v18.9,115.21 | v20.27,133.27 v20.27,143.71
ADDR_BUS14  (via drill 0.35)
  Top 0.152: v22.48,106.22 21.41,106.22 BANKC.2 | v23.39,125.2 23.09,125.2 22.78,125.5 22.17,125.5 21.95,125.27 21.41,125.27 BANKB.2 | v22.48,143.71 21.95,144.25 21.41,144.25 BANKA.2 | v68.05,94.64 68.05,95.56 SW_PROD_4.9
  Route2 0.152: v68.05,94.64 68.05,98.45 58.9,107.59 58.9,109.88 58.6,110.19 41.68,110.19 37.72,106.22 v22.48,106.22
  Bottom 0.152: v22.48,106.22 22.48,119.63 23.39,120.55 v23.39,125.2 23.47,125.27 23.47,126.49 22.48,127.48 v22.48,143.71
ADDR_BUS15  (via drill 0.35)
  Top 0.152: v17.07,110.8 21.11,106.76 21.34,106.76 BANKC.1 21.41,106.76 23.93,109.27 26.29,109.27 26.59,108.97 26.59,95.86 32.99,89.46 v32.99,88.16 | v21.95,126.49 21.95,126.34 21.41,125.81 BANKB.1 | v22.48,144.7 21.41,144.7 BANKA.1 | v51.82,89.53 58.37,89.53 64.08,95.25 64.08,95.78 67.67,99.36 68.05,99.36 SW_PROD_4.12
  Bottom 0.152: v17.07,110.8 17.07,113.54 16,114.61 16,115.21 21.87,121.08 21.87,126.42 v21.95,126.49 21.95,132.51 21.87,132.59 21.87,144.09 v22.48,144.7 | v51.82,89.53 44.96,89.53 43.2,87.78 33.38,87.78 v32.99,88.16
ADDR_BUS16  (via drill 0.35)
  Top 0.152: v39.24,112.62 39.24,109.73 40.62,108.36 BANKC.48 | v39.47,125.04 39.78,125.35 39.78,125.42 40.08,125.73 40.62,125.73 BANKB.48 40.69,125.81 43.36,128.47 50.6,128.47 51.13,129.01 51.13,140.82 47.24,144.7 40.69,144.7 BANKA.48
  Route2 0.152: v65.84,101.58 59.21,108.2 59.21,110.03 56.62,112.62 v39.24,112.62
  Bottom 0.152: v39.24,112.62 39.24,113.46 39.85,114.07 39.85,117.58 38.56,118.87 38.56,124.13 v39.47,125.04 | v65.84,101.58 66.75,100.66 68.05,100.66 SW_PROD_5.4
ADDR_BUS17  (via drill 0.35)
  Top 0.152: v20.27,99.29 20.8,98.75 21.34,98.75 BANKC.17 | v19.43,112.85 19.43,113.77 20.57,114.91 20.57,117.5 20.8,117.73 21.34,117.73 BANKB.17 | v18.29,114 17.22,115.06 17.22,133.12 20.8,136.7 21.34,136.7 BANKA.17
  Route15 0.152: v53.87,96.24 51.21,96.24 50.06,95.1 24.46,95.1 v20.27,99.29
  Bottom 0.152: v20.27,99.29 20.27,102.87 18.67,104.47 18.67,112.09 v19.43,112.85 v18.29,114 | v53.87,96.24 63.02,96.24 63.55,96.77 68.05,96.77 SW_PROD_5.7
ADDR_BUS18  (via drill 0.35)
  Top 0.152: v25.53,104.62 23.09,102.18 23.09,100.43 21.95,99.29 21.41,99.29 BANKC.16 | v26.44,113.92 26.14,113.92 22.17,117.88 22.17,118.03 22.02,118.19 21.41,118.19 BANKB.16 | v23.09,136.09 21.95,137.24 21.41,137.24 BANKA.16
  Route15 0.152: v50.6,98.6 31.55,98.6 v25.53,104.62
  Bottom 0.152: 25.53,108.05 25.53,108.2 25.38,108.36 25.38,109.5 27.66,111.78 27.66,112.7 v26.44,113.92 | 25.53,108.05 v25.53,104.62 | v23.09,136.09 23.09,135.64 28.88,129.84 28.88,110.64 26.29,108.05 25.53,108.05 | v50.6,98.6 53.57,95.63 61.87,95.63 SW_PROD_5.9
ADDR_BUS19  (via drill 0.35)
  Top 0.152: v19.43,104.7 19.43,103.71 20.34,102.79 21.34,102.79 BANKC.9 | v25.22,115.75 25.22,119.18 22.71,121.69 21.41,121.69 BANKB.9 | v25.53,125.2 24.69,126.03 24.69,138 21.95,140.74 21.41,140.74 BANKA.9
  Route2 0.152: v19.43,104.7 19.43,105 25.22,110.8 v25.22,115.75
  Route15 0.152: v63.48,99.36 61.87,99.36 60.12,97.61 48.08,97.61 46.94,96.47 28.73,96.47 20.5,104.7 v19.43,104.7
  Bottom 0.152: v25.53,125.2 25.53,116.05 v25.22,115.75 | v63.48,99.36 61.95,99.36 SW_PROD_5.12
ADDR_SHIFT  (via drill 0.35)
  Top 0.152: v8.23,88.62 6.33,86.72 JP3.5
  Bottom 0.152: ADD_LOW.2 146.07,132.59 ADD_LOW.1 146,133.88 146,142.8 142.49,146.3 142.49,147.22 139.45,150.27 25.45,150.27 4.65,129.46 4.65,96.32 5.03,95.94 6.93,95.94 8.23,94.64 v8.23,88.62
B  (via drill 0.35)
  Top 0.152: v143.56,15.47 144.17,16.08 153.01,16.08 154.76,14.33 163.07,14.33 v163.98,15.24
  Bottom 0.152: v143.56,15.47 143.56,16.76 IC27.36 | v163.98,15.24 163.98,17.3 163.83,17.45 163.83,18.75 164.36,19.28 173.43,19.28 176.63,16.08 176.63,15.32 175.79,14.48 175.41,14.48 RN2.19
BANKA_PROG  (via drill 0.35)
  Top 0.152: v15.54,126.26 15.54,134.49 20.73,139.68 21.34,139.68 BANKA.11
  Bottom 0.152: v15.54,126.26 15.54,117.5 14.02,115.98 14.02,79.02 R12.1 13.95,78.94 12.57,77.57 6.33,77.57 JP4.5
BANKB_PROG  (via drill 0.35)
  Top 0.152: v20.12,120.7 21.34,120.7 BANKB.11
  Bottom 0.152: v20.12,120.7 19.2,120.7 14.86,116.36 14.86,76.89 14.02,76.05 R13.1 13.95,75.97 12.88,74.91 11.35,74.91 11.28,74.98 6.33,74.98 JP4.3
BANKC_PROG
  Top 0.152: BANKC.11 21.34,101.73 17.53,101.73 6.02,90.22 5.87,90.22 5.26,89.61 5.26,73.46 6.25,72.47 JP4.1
  Bottom 0.152: R14.1 13.95,73.08 13.79,73.08 12.8,74.07 7.92,74.07 6.33,72.47 JP4.1
C  (via drill 0.35)
  Route15 0.152: v145.16,14.86 147.37,14.86 147.45,14.94 154.61,14.94 154.91,14.63 v169.24,14.63
  Bottom 0.152: v145.16,14.86 143.26,14.86 142.88,15.24 142.88,16.76 IC27.35 | v169.24,14.63 170.16,14.63 171.6,13.18 175.34,13.18 RN2.18
CLEAR
  Top 0.152: IC10.3 166.95,133.27 167.34,133.27 176.71,142.65 176.71,148.97 CLEAR_OUNS.2
CLK
  Bottom 0.152: U$4.2 158.19,135.94 158.19,136.4 169.09,147.29 180.75,147.29 182.42,148.97 POWER_PINS.1
D  (via drill 0.35)
  Top 0.152: v143.49,18.14 151.41,18.14 154.91,14.63 162.46,14.63 164.06,16.23 v165.81,16.23
  Bottom 0.152: v143.49,18.14 142.8,18.14 142.04,17.37 142.04,16.84 IC27.34 | v165.81,16.23 166.73,16.23 171.22,11.73 175.18,11.73 175.34,11.89 RN2.17
DATA_ADDR_CLOCK  (via drill 0.35)
  Top 0.152: 129.04,100.09 138.23,109.27 145.09,109.27 146,110.19 BC_LOW.8 146.07,110.26 147.07,110.26 148.59,111.78 v148.59,114.53 | 129.04,100.09 126.72,97.77 126.72,95.4 124.51,93.19 124.13,93.19 BA_LOW.8 | v146.91,124.28 146.07,125.12 BC_HIGH.8 | v91.44,118.11 91.44,118.57 v93.12,120.24 93.12,120.17 106.15,120.17 v120.62,105.69 | v5.26,90.98 5.26,92.2 6.4,93.34 6.63,93.34 14.33,101.04 v14.33,137.69 | 129.04,100.09 129.46,99.67 v129.46,99.59
  Route15 0.152: v71.4,140.36 71.4,137.92 71.32,137.85 71.32,137.77 90.98,118.11 v91.44,118.11
  Bottom 0.152: v146.91,124.28 146.91,120.47 148.59,118.8 v148.59,114.53 | v91.44,118.11 91.44,111.63 92.81,110.26 93.88,110.26 BB_LOW.8 | v93.12,120.24 93.12,124.36 93.88,125.12 BB_HIGH.8 | v71.4,140.36 71.4,145.62 67.06,149.96 60.66,149.96 59.21,148.51 59.21,148.13 BA_HIGH.8 59.13,148.06 23.7,148.06 14.33,138.68 v14.33,137.69 | v5.26,90.98 6.25,89.99 6.25,89.31 JP3.7 | v129.46,99.59 123.37,105.69 v120.62,105.69
DATAA0  (via drill 0.35)
  Top 0.152: v177.39,51.59 179.53,49.45 179.53,45.95 IC5.1 | v49.61,129.08 49.61,129.31 43.74,135.18 40.69,135.18 BANKA.29 | v96.01,117.27 95.56,117.27 94.41,118.42 93.95,118.42 IC3.1 | v114,98.3 117.88,98.3 BA_LOW.3 | v177.39,71.86 143.33,71.86 143.03,71.55 141.88,71.55 v141.5,71.93
  Route2 0.152: v49.61,129.08 50.22,128.47 50.22,128.4 53.8,124.82 53.8,124.13 59.82,118.11 90.53,118.11 91.14,118.72 94.56,118.72 v96.01,117.27 96.01,116.28 v114,98.3 119.86,92.43 121.01,92.43 v141.5,71.93
  Bottom 0.152: v177.39,51.59 v177.39,71.86 177.39,77.88 180.52,81 IC4.1
DATAA1  (via drill 0.35)
  Top 0.152: v180.21,47.55 180.82,46.94 180.82,45.95 IC5.2 | v49.3,130.53 48.84,130.53 43.13,136.25 40.69,136.25 BANKA.31 | v95.48,114.68 95.48,114.99 96.09,115.59 96.09,116.2 95.17,117.12 93.95,117.12 IC3.2 | 119.18,97 119.86,97 120.7,97.84 120.7,103.48 v120.09,104.09 | 119.18,97 117.96,97 BA_LOW.4 | v178,76.89 173.58,76.89 173.51,76.96 155.68,76.96 151.49,72.77 v128.85,72.77 | v116.66,84.89 116.66,93.65 116.89,93.88 119.02,93.88 119.18,94.03 119.18,97
  Route2 0.152: v49.3,130.53 49.3,129.69 49,129.39 49,127.79 59.28,117.5 90.68,117.5 93.5,114.68 v95.48,114.68
  Bottom 0.152: v180.21,47.55 180.21,49.15 178,51.36 178,76.81 178.04,76.85 | 178.04,76.85 181.81,80.62 181.81,81 IC4.2 | v120.09,104.09 98.98,104.09 96.93,106.15 96.93,111.02 97.31,111.4 97.31,112.93 95.56,114.68 v95.48,114.68 | v128.85,72.77 126.34,72.77 116.66,82.45 v116.66,84.89 | v178,76.89 178.04,76.85
DATAA2  (via drill 0.35)
  Top 0.152: v181.13,47.55 182.04,46.63 182.04,45.95 IC5.3 | v41.76,137.16 41.68,137.24 40.69,137.24 BANKA.33 | v95.48,115.9 93.95,115.9 IC3.3 | v115.37,96.01 115.59,95.78 117.88,95.78 BA_LOW.5 | v176.71,71.25 141.28,71.25 v140.59,71.93
  Route2 0.152: v49.84,127.86 49.84,127.64 59.66,117.81 90.83,117.81 92.73,115.9 v95.48,115.9 v115.37,96.01 121.61,89.76 121.84,89.76 139.68,71.93 v140.59,71.93
  Bottom 0.152: v181.13,47.55 180.52,46.94 179.91,46.94 176.78,50.06 176.78,71.25 | 176.78,71.25 176.78,79.02 180.14,82.37 182.27,82.37 183.03,81.61 183.03,81.08 IC4.3 | v41.76,137.16 49,129.92 49,128.7 v49.84,127.86 | v176.71,71.25 176.78,71.25
DATAA3  (via drill 0.35)
  Top 0.152: v183.34,47.55 183.34,45.95 IC5.4 | v48.84,131.44 42.06,138.23 40.69,138.23 BANKA.35 | v90.14,116.89 91.21,116.89 93.42,114.68 93.88,114.68 IC3.4 | v112.78,97 115.29,94.49 117.88,94.49 BA_LOW.6 | v173.2,76.35 155.52,76.35 151.33,72.16 v142.72,72.16
  Route2 0.152: v48.84,131.44 48.84,130.99 48.69,130.84 48.69,127.64 59.44,116.89 v90.14,116.89 92.96,114.07 96.16,114.07 112.78,97.46 v112.78,97 120.32,89.46 121.69,89.46 139.83,71.32 141.88,71.32 v142.72,72.16
  Bottom 0.152: v183.34,47.55 183.34,63.78 179.22,67.89 179.22,69.34 183.79,73.91 183.79,80.47 184.33,81 IC4.4 184.33,81.08 184.33,81.53 183.19,82.68 179.53,82.68 v173.2,76.35
DATAA4  (via drill 0.35)
  Top 0.152: v184.71,48.23 184.71,45.95 IC5.5 | v50.52,129.31 50.52,132.51 43.36,139.68 40.69,139.68 BANKA.38 | v79.93,118.72 87.4,118.72 89.04,117.08 | 89.04,117.08 92.73,113.39 93.88,113.39 IC3.5 | 122.8,96.58 122.76,96.62 122.76,97.38 123.06,97.69 125.2,97.69 125.35,97.84 125.35,102.79 104.93,123.22 100.13,123.22 97.38,120.47 93.8,120.47 93.42,120.85 92.81,120.85 89.04,117.08 | 122.8,96.58 123.6,95.78 124.05,95.78 BA_LOW.10 | v137.47,68.81 v184.71,68.81 | v125.81,80.16 125.81,85.65 121.39,90.07 121.39,91.82 122.3,92.73 122.3,94.18 121.69,94.79 121.69,95.48 122.8,96.58
  Route2 0.152: v50.52,129.31 50.52,128.55 54.1,124.97 54.1,124.28 59.66,118.72 v79.93,118.72 | v137.47,68.81 137.16,68.81 v125.81,80.16
  Bottom 0.152: v184.71,48.23 v184.71,68.81 184.71,72.31 186.23,73.84 186.23,77.95 185.62,78.56 185.62,81 IC4.5
DATAA5  (via drill 0.35)
  Top 0.152: v126.11,95.71 124.89,96.93 124.13,96.93 BA_LOW.11 | v126.8,92.58 126.8,73 125.27,71.48 v125.27,56.54 | v121.77,53.03 121.77,51.44 117.65,47.32 v117.65,43.89 117.65,38.94 117.27,38.56 117.27,30.02 EXTRA_1_2_PINS.1 | v41.83,140.74 40.69,140.74 BANKA.40 | v36.88,94.41 36.88,81.69 v39.24,79.32
  Route2 0.152: v77.34,34.98 74.07,34.98 73.84,34.75 64.31,34.75 63.63,34.06 62.94,34.06 54.33,42.67 50.75,42.67 42.29,51.13 42.29,57 41.3,57.99 EXTRA1.K
  Bottom 0.152: v126.11,95.71 126.11,94.26 126.8,93.57 v126.8,92.58 | v121.77,53.03 v125.27,56.54 | v41.83,140.74 41.83,140.06 33.3,131.52 33.3,106.53 36.88,102.95 v36.88,94.41 | v39.24,79.32 39.24,60.5 37.8,59.05 37.8,57 38.41,56.39 39.62,56.39 41.22,57.99 EXTRA1.K | v117.65,43.89 99.36,43.89 98.45,44.81 97.54,44.81 87.71,34.98 v77.34,34.98
DATAA6  (via drill 0.35)
  Top 0.152: BA_LOW.12 124.05,98.22 123.14,98.22 121.08,96.16 121.08,83.52 123.6,81 123.6,63.86 118.03,58.29 118.03,50.75 114.99,47.7 114.99,30.25 114.76,30.02 EXTRA_1_2_PINS.2 | v39.47,139.37 39.47,141.12 40.08,141.73 40.62,141.73 BANKA.42 | v42.82,116.66 42.82,116.2 50.6,108.43 50.6,99.52 51.21,98.91 51.21,77.65 47.24,73.69 47.24,58.06 EXTRA2.K
  Route2 0.152: v39.47,139.37 39.47,137.69 42.82,134.34 v42.82,116.66 | EXTRA_1_2_PINS.2 114.68,29.95 114.15,29.95 113.23,29.03 107.9,29.03 107.21,29.72 106.91,29.72 87.33,49.3 56.01,49.3 47.32,57.99 EXTRA2.K
DATAA7  (via drill 0.35)
  Top 0.152: v45.8,142.8 40.69,142.8 BANKA.44 | 122.87,98.79 120.17,96.09 v120.17,94.49 | 122.87,98.79 123.6,99.52 124.05,99.52 BA_LOW.13 | v69.34,141.43 75.51,141.43 75.74,141.66 87.4,141.66 v88.85,140.21 | v104.62,122.61 121.23,105.99 121.23,100.43 122.87,98.79
  Route2 0.152: v109.42,56.77 82.68,56.77 80.54,58.9 56.31,58.9 55.47,58.06 53.34,58.06 EXTRA3.K
  Route15 0.152: v45.8,142.8 46.1,142.8 v47.32,141.58 | v120.17,94.49 120.17,94.26 109.42,83.52 v109.42,56.77 109.42,41.3 120.7,30.02 EXTRA_3_4_PINS.1 | v88.85,140.21 104.62,124.44 v104.62,122.61
  Bottom 0.152: v47.32,141.58 55.02,141.58 57.68,144.25 63.63,144.25 65.53,142.34 65.53,141.96 BA_HIGH.2 65.61,141.96 66.75,141.96 BA_HIGH.1 66.83,141.88 68.89,141.88 v69.34,141.43
DATAA8  (via drill 0.35)
  Top 0.152: v39.47,135.79 40.62,135.79 BANKA.30 | v59.97,137.31 59.97,134.04 58.29,132.36 v58.29,109.58 | v61.57,65.68 61.57,60.35 59.28,58.06 EXTRA4.K
  Route2 0.152: v113,33.98 98.75,48.23 97.23,48.23 89.69,55.78 63.63,55.78 61.42,57.99 59.28,57.99 EXTRA4.K | v58.29,109.58 58.29,107.82 58.6,107.52 58.6,107.06 62.56,103.1 v62.56,94.64
  Route15 0.152: v39.47,135.79 58.45,135.79 v59.97,137.31
  Bottom 0.152: v59.97,137.31 60.12,137.31 64.24,141.43 64.24,141.88 BA_HIGH.3 | v113,33.98 119.25,33.98 123.22,30.02 EXTRA_3_4_PINS.2 | v62.56,94.64 62.56,66.67 v61.57,65.68
DATAA9  (via drill 0.35)
  Top 0.152: v39.47,136.78 40.62,136.78 BANKA.32 | v62.26,140.36 62.26,138.68 60.27,136.7 60.27,133.88 58.9,132.51 58.9,109.27 v51.82,102.18
  Route2 0.152: v51.82,102.18 51.51,102.18 49.07,99.75 49.07,98.75 v64.92,82.91
  Route15 0.152: v39.47,136.78 40.46,136.78 41.83,138.15 43.66,138.15 v44.88,139.37 | v114.3,35.28 93.8,55.78 67.67,55.78 65.46,57.99 65.3,57.99 EXTRA5.K
  Bottom 0.152: v44.88,139.37 53.26,139.37 57.84,143.94 61.42,143.94 62.94,142.42 62.94,141.96 BA_HIGH.4 62.94,141.88 62.94,141.05 v62.26,140.36 | v114.3,35.28 123.98,35.28 129.24,30.02 EXTRA_5_6_PINS.1 | v64.92,82.91 64.92,69.42 69.65,64.69 69.65,57 69.04,56.39 66.9,56.39 65.3,57.99 EXTRA5.K
DATAA10  (via drill 0.35)
  Top 0.152: 38.9,138.95 38.86,138.99 38.86,144.02 40.01,145.16 56.16,145.16 v58.29,143.03 | 38.9,138.95 40.08,137.77 40.62,137.77 BANKA.34 | 38.9,138.95 38.63,138.68 38.56,138.68 37.64,137.77 v37.64,111.78 | v41.6,88.39 41.6,81.99 47.78,75.82 47.78,74.68 46.94,73.84 46.94,59.59 46.33,58.98 46.33,57 46.94,56.39 69.65,56.39 71.25,57.99 EXTRA6.K
  Route2 0.152: EXTRA6.K 71.32,57.99 81,57.99 82.6,56.39 96.62,56.39 119.94,33.07 123.67,33.07 126.72,30.02 EXTRA_5_6_PINS.2
  Bottom 0.152: v58.29,143.03 58.6,143.03 58.75,143.18 59.66,143.18 59.89,142.95 59.89,140.82 60.05,140.66 60.88,140.66 61.72,141.5 61.72,141.88 BA_HIGH.5 | v37.64,111.78 37.64,102.11 38.25,101.5 38.25,91.75 v41.6,88.39
DATAA11  (via drill 0.35)
  Top 0.152: v43.36,138.76 40.69,138.76 BANKA.36 | v13.72,120.62 2.44,109.35 2.44,65.91 6.25,62.1 6.25,58.06 A_CLEAR_LED.K | v76.43,15.62 77.42,14.63 77.42,13.79 ABC_CLEAR.1 | v63.86,16.99 25.76,16.99 19.2,23.55 19.2,24 15.54,27.66 14.63,27.66 8.53,33.76 7.39,33.76 v7.01,33.38
  Route2 0.152: v76.43,15.62 72.47,15.62 71.09,16.99 v63.86,16.99
  Route15 0.152: v13.72,120.62 31.85,138.76 v43.36,138.76
  Bottom 0.152: v43.36,138.76 53.11,138.76 57.99,143.64 59.66,143.64 60.43,142.88 60.43,141.96 BA_HIGH.6 | v7.01,33.38 5.94,33.38 5.33,33.98 5.33,57.07 6.25,57.99 A_CLEAR_LED.K
DATAA12  (via drill 0.35)
  Top 0.152: v43.74,140.89 42.98,140.13 41.53,140.13 41.45,140.21 40.69,140.21 BANKA.39 | v31.85,91.52 31.85,114.61 v33.91,116.66
  Route2 0.152: ABC_CLEAR.2 79.93,13.72 79.17,13.72 77.42,11.96 74.6,11.96 69.95,7.32 67.44,7.32 55.09,19.66 47.7,19.66 45.72,21.64 37.34,21.64 35.66,23.32 35.66,23.39 24.99,34.06 23.93,34.06 17.37,40.62 17.37,57.15 18.21,57.99 B_CLEAR_LED.K
  Bottom 0.152: BA_HIGH.10 61.72,148.06 61.72,147.14 60.73,146.15 50.52,146.15 45.26,140.89 v43.74,140.89 40.84,138 40.84,136.25 33.91,129.31 v33.91,116.66 | v31.85,91.52 20.04,79.7 20.04,69.34 18.29,67.59 18.29,58.06 B_CLEAR_LED.K
DATAA13  (via drill 0.35)
  Top 0.152: v42.82,141.5 41.68,141.5 41.45,141.28 40.69,141.28 BANKA.41 | v29.11,101.96 29.11,111.86 v30.48,113.23
  Route2 0.152: ABC_CLEAR.3 82.53,13.72 81.38,13.72 79.32,11.66 74.75,11.66 69.8,6.71 60.2,6.71 45.57,21.34 34.06,21.34 13.18,42.22 13.18,57.15 12.34,57.99 D_CLEAR_LED.K
  Bottom 0.152: BA_HIGH.11 62.94,148.13 62.94,148.59 62.18,149.35 61.27,149.35 61.11,149.2 61.11,146.99 60.58,146.46 50.37,146.46 45.41,141.5 v42.82,141.5 42.82,141.96 40.69,144.09 39.01,144.09 30.48,135.56 v30.48,113.23 | v29.11,101.96 29.11,89.23 19.74,79.86 19.74,69.49 12.34,62.1 12.34,58.06 D_CLEAR_LED.K
DATAA14  (via drill 0.35)
  Top 0.152: v48.77,142.19 41.76,142.19 | 41.76,142.19 40.69,142.19 BANKA.43 | v16.99,68.58 16.99,62.79 23.39,56.39 30.1,56.39 31.7,57.99 32.23,57.99 PAUSE_INERUPT.K | 41.76,142.19 v41.76,142.11 | v75.21,55.17 71.63,55.17 71.32,54.86 37.41,54.86 v36.8,54.25
  Route2 0.152: v75.21,55.17 80.77,49.61 87.63,49.61 107.21,30.02 108.66,30.02 INTERUPTS.1
  Bottom 0.152: v48.77,142.19 55.17,142.19 58.52,145.54 64.69,145.54 66.14,146.99 66.14,149.2 65.99,149.35 65.08,149.35 64.31,148.59 64.31,148.13 BA_HIGH.12 | v16.99,68.58 16.99,89.46 23.39,95.86 23.39,99.36 32.08,108.05 32.08,136.7 39.17,143.79 40.08,143.79 v41.76,142.11 | v36.8,54.25 36.04,54.25 32.31,57.99 PAUSE_INERUPT.K
DATAA15  (via drill 0.35)
  Top 0.152: v48.16,142.88 47.62,143.41 45.49,143.41 45.34,143.26 40.69,143.26 BANKA.45 | v24.46,77.88 24.46,78.26 34.21,88.01 v34.21,106.83 | v100.05,33.53 101.19,32.38 108.43,32.38 110.8,30.02 111.25,30.02 INTERUPTS.2
  Route2 0.152: v24.46,77.88 26.21,76.12 26.21,58.06 PLAY_INTERUPT.K | v100.05,33.53 53.03,33.53 32.38,54.18 v30.1,54.18
  Bottom 0.152: BA_HIGH.13 65.53,148.06 65.53,147.6 63.78,145.85 58.37,145.85 55.4,142.88 v48.16,142.88 47.7,142.88 45.11,140.28 43.97,140.28 41.15,137.47 41.15,136.09 35.43,130.38 35.43,117.27 34.21,116.05 v34.21,106.83 | v30.1,54.18 26.29,57.99 PLAY_INTERUPT.K
DATAA_SHIFT
  Top 0.152: BA_LOW.1 117.96,100.74 117.96,99.59 BA_LOW.2 117.88,99.52 103.02,99.52 81.53,78.03 78.79,78.03 76.43,75.67 76.43,55.47 75.51,54.56 38.02,54.56 36.73,53.26 12.5,53.26 7.16,58.6 7.16,63.78 4.42,66.52 4.42,70.41 2.74,72.08 2.74,85.8 3.66,86.72 JP3.6
DATAB0  (via drill 0.35)
  Top 0.152: v43.28,114.38 41.45,116.2 40.69,116.2 BANKB.29 | v137.24,107.29 139.29,107.29 140.82,108.81 151.41,108.81 157.73,102.49 159.87,102.49 IC21.1
  Route2 0.152: v43.28,114.38 45.49,114.38 46.94,112.93 65.46,112.93 67.44,110.95 v91.21,110.95
  Route15 0.152: v91.21,110.95 97.99,110.95 v101.65,114.61
  Bottom 0.152: BB_LOW.3 100.13,115.21 100.74,114.61 v101.65,114.61 101.73,114.61 107.97,108.36 122.53,108.36 123.6,107.29 v137.24,107.29
DATAB1  (via drill 0.35)
  Top 0.152: v51.74,114.68 49.76,114.68 47.17,117.27 40.69,117.27 BANKB.31 | v98.83,107.75 105.99,107.75 v106.83,108.58 | v136.55,106.68 139.14,106.68 140.97,108.51 151.26,108.51 158.57,101.19 159.87,101.19 IC21.2
  Route2 0.152: v51.74,114.68 53.49,114.68 54.1,115.29 90.37,115.29 97.92,107.75 v98.83,107.75
  Bottom 0.152: BB_LOW.4 100.13,114 101.42,114 v106.83,108.58 107.37,108.05 122.38,108.05 123.75,106.68 v136.55,106.68
DATAB2  (via drill 0.35)
  Top 0.152: v39.47,118.87 40.08,118.26 40.62,118.26 BANKB.33 | v137.85,106.07 138.99,106.07 141.12,108.2 151.1,108.2 159.33,99.97 159.87,99.97 IC21.3
  Route2 0.152: v63.78,120.55 64.69,119.63 95.48,119.63 101.65,113.46 v101.65,112.85
  Bottom 0.152: v39.47,118.87 39.47,120.32 38.86,120.93 38.86,121.54 39.17,121.84 45.34,121.84 46.63,120.55 v63.78,120.55 | BB_LOW.5 100.13,112.78 100.2,112.85 v101.65,112.85 106.83,107.67 122.3,107.67 123.9,106.07 v137.85,106.07
DATAB3  (via drill 0.35)
  Top 0.152: v54.41,114.68 54.41,114.76 52.65,116.51 49.3,116.51 46.63,119.18 40.69,119.18 BANKB.35 | v165.96,103.86 167.26,103.86 189.43,81.69 IC22.1 | v148.28,104.47 135.25,104.47 v135.03,104.24
  Route2 0.152: v54.41,114.68 56.62,114.68 56.69,114.76 88.77,114.76 96.47,107.06 98.22,107.06 v98.45,106.83
  Bottom 0.152: v98.45,106.83 98.83,106.83 101.31,109.31 | 101.31,109.31 101.35,109.35 101.35,110.64 100.58,111.4 100.13,111.4 BB_LOW.6 | v165.96,103.86 164.52,103.86 163.91,104.47 v148.28,104.47 | v135.03,104.24 125.27,104.24 122.22,107.29 103.33,107.29 101.31,109.31
DATAB4  (via drill 0.35)
  Top 0.152: v50.44,117.88 48.84,117.88 46.02,120.7 40.69,120.7 BANKB.38 | 184.82,85.84 167.41,103.25 165.66,103.25 163.91,105 163.91,107.9 v160.71,111.1 | 184.82,85.84 188.14,82.53 188.14,81.08 IC22.2 | 184.82,85.84 v184.4,85.42
  Route2 0.152: v184.4,85.42 147.37,48.39 147.37,48.31 146.15,47.09 145.01,47.09 128.32,30.4 128.32,29.11 119.71,20.5 105.39,20.5 98.91,14.02 97.77,14.02 PC_INC_DEC.2
  Route15 0.152: v50.44,117.88 52.35,115.98 52.35,114.99 54.41,112.93 v66.37,112.93 | v160.71,111.1 160.55,111.1 157.35,114.3 153.62,114.3 152.86,113.54 128.17,113.54 125.88,115.82 99.9,115.82 v96.7,112.62
  Bottom 0.152: v66.37,112.93 87.25,112.93 92.73,107.44 93.34,107.44 95.48,109.58 95.48,111.63 95.44,111.67 | 95.44,111.67 94.41,112.7 93.95,112.7 BB_LOW.10 | v96.7,112.62 95.78,111.71 95.48,111.71 95.44,111.67
DATAB5  (via drill 0.35)
  Top 0.152: v54.41,119.33 47.85,119.33 45.49,121.69 40.69,121.69 BANKB.40 | v136.25,73.99 151.79,73.99 156.97,79.17 185.47,79.17 186.84,80.54 186.84,81 IC22.3
  Route2 0.152: v54.41,119.33 56.54,119.33 59.36,116.51 89.61,116.51 93.57,112.55 v95.71,112.55 95.71,111.78 133.5,73.99 v136.25,73.99
  Bottom 0.152: v95.71,112.55 95.17,113.08 95.17,113.16 94.34,114 93.95,114 BB_LOW.11
DATAB6  (via drill 0.35)
  Top 0.152: v46.63,122.76 40.69,122.76 BANKB.42 | v96.85,122.61 94.18,122.61 91.29,125.5 78.87,125.5 76.12,122.76 v67.36,122.76 67.36,121.69 67.13,121.46 67.13,108.13 72.39,102.87 v72.39,98.68
  Route2 0.152: v67.36,122.76 v62.18,122.76 | C_IN.K 37.34,22.94 37.95,22.94 38.94,21.95 46.25,21.95 47.47,20.73 52.81,20.73 53.49,21.41 82.07,21.41 83.59,22.94 83.59,23.16 86.33,25.91 101.27,25.91 104.17,23.01 IN_C_D_X.1
  Route15 0.152: v72.39,98.68 72.39,87.17 74.52,85.04 74.52,79.4 61.42,66.29 61.27,66.29 54.18,59.21 54.18,57.23 45.19,48.23 45.19,30.86 37.34,23.01 C_IN.K
  Bottom 0.152: v62.18,122.76 v46.63,122.76 | v96.85,122.61 96.85,121.84 97,121.69 97,116.51 95.78,115.29 93.95,115.29 BB_LOW.12
DATAB7  (via drill 0.35)
  Top 0.152: v54.71,124.59 53.95,123.83 40.69,123.83 BANKB.44 | 49.95,40.2 50.52,40.77 67.06,40.77 74.22,33.6 74.22,25.91 v75.44,24.69 | 49.95,40.2 44.81,35.05 43.28,35.05 D_IN_L.K | v60.88,123.37 60.88,105.08 60.66,104.85 60.66,102.72 60.88,102.49 63.02,102.49 64.08,101.42 64.08,97.31 62.94,96.16 60.81,96.16 v59.28,94.64 | 49.95,40.2 v49.68,40.46
  Route2 0.152: v54.71,124.59 56.16,123.14 56.16,123.06 59.89,119.33 94.87,119.33 v95.78,118.42 | v75.44,24.69 77.5,24.69 78.33,25.53 84.05,25.53 86.72,28.19 100.74,28.19 105.92,23.01 106.68,23.01 IN_C_D_X.2
  Bottom 0.152: BB_HIGH.1 100.05,132.74 100.05,131.6 BB_HIGH.2 99.97,131.6 98.98,131.6 95.78,128.4 v95.78,118.42 95.78,117.96 94.41,116.59 93.95,116.59 BB_LOW.13 | v54.71,124.59 59.66,124.59 v60.88,123.37 | v59.28,94.64 59.28,67.82 52.35,60.88 52.35,53.57 46.79,48.01 46.79,43.36 v49.68,40.46
DATAB8  (via drill 0.35)
  Top 0.152: v43.89,102.95 43.89,114.68 41.83,116.74 40.69,116.74 BANKB.30 | v98.22,129.92 95.33,129.92 94.94,130.3 88.47,130.3 v87.86,130.91 | v104.01,29.57 109.19,24.38 109.19,23.01 IN_C_D_X.3
  Route2 0.152: v43.89,102.95 43.89,102.03 38.63,96.77 v38.63,81.69 | v104.01,29.57 99.9,29.57 99.82,29.49 59.05,29.49 55.63,32.92 39.4,32.92 37.34,34.98 D_IN_H.K
  Route15 0.152: v66.37,107.75 63.02,104.39 45.34,104.39 v43.89,102.95
  Bottom 0.152: v38.63,81.69 38.63,60.35 37.41,59.13 37.41,48.08 37.34,48.01 37.34,35.05 D_IN_H.K | v98.22,129.92 98.53,130.23 100.05,130.23 BB_HIGH.3 | v87.86,130.91 84.12,130.91 82.14,128.93 74.52,128.93 66.52,120.93 66.52,114 65.76,113.23 65.76,108.36 v66.37,107.75
DATAB9  (via drill 0.35)
  Top 0.152: v52.96,115.29 49.61,115.29 47.17,117.73 40.69,117.73 BANKB.32 | v73.53,126.49 85.19,126.49 86.49,127.79 95.17,127.79 96.39,129.01 v98.53,129.01
  Route2 0.152: v49.76,95.71 49.76,66.06 51.36,64.47 v51.36,62.33
  Route15 0.152: v52.96,115.29 62.79,115.29 73.53,126.03 v73.53,126.49 | v51.21,24.61 54.94,24.61 58.52,28.19 106.6,28.19 111.78,23.01 IN_C_D_X.4
  Bottom 0.152: v98.53,129.01 100.05,129.01 BB_HIGH.4 | 44.2,23.01 45.8,23.01 47.4,24.61 v51.21,24.61 | 44.2,23.01 43.28,23.01 X_IN.K | v52.96,115.29 52.96,104.24 48.77,100.05 48.77,97.69 49.76,96.7 v49.76,95.71 | v51.36,62.33 51.36,60.66 48.77,58.06 48.77,53.42 43.36,48.01 43.36,36.88 44.2,36.04 44.2,23.01
DATAB10  (via drill 0.35)
  Top 0.152: v51.51,115.9 49.45,115.9 46.63,118.72 40.69,118.72 BANKB.34 | v71.17,115.9 75.74,115.9 81.31,121.46 96.32,121.46 v96.39,121.39 | v72.31,34.14 63.32,25.15 63.32,23.01 IR_IN.K | v73.69,35.51 73.69,49.61 78.56,54.48 78.56,61.27 90.07,72.77 v90.07,79.32
  Route2 0.152: v51.51,115.9 54.1,115.9 54.18,115.82 71.09,115.82 v71.17,115.9
  Route15 0.152: v90.07,79.32 90.07,114 96.39,120.32 v96.39,121.39
  Bottom 0.152: IR_IN.K 63.32,22.94 65.23,22.94 70.26,17.91 100.2,17.91 102.18,19.89 112.62,19.89 115.44,22.71 PC_MAR_IR_IN.1 | v96.39,121.39 96.39,122.15 96.24,122.3 96.24,124.36 99.59,127.71 100.05,127.71 BB_HIGH.5 | v73.69,35.51 v72.31,34.14
DATAB11  (via drill 0.35)
  Top 0.152: v54.41,117.58 54.1,117.27 49,117.27 46.56,119.71 40.69,119.71 BANKB.36 | 70.26,121.16 74.98,121.16 79.02,125.2 91.14,125.2 94.34,122 97.16,122 97.61,122.45 v97.61,123.6 | 70.26,121.16 v67.74,121.16 | v112.78,16.54 112.78,17.53 117.96,22.71 PC_MAR_IR_IN.2 | 70.26,121.16 70.26,105.46 73.3,102.41 v73.3,98.68
  Route15 0.152: v54.41,117.58 57.99,121.16 v67.74,121.16 | v73.3,98.68 73.3,86.72 74.83,85.19 74.83,78.94 62.18,66.29 62.18,64.77 51.59,54.18 v51.59,43.51
  Bottom 0.152: v97.61,123.6 97.61,124.89 99.14,126.42 100.05,126.42 BB_HIGH.6 | 58.67,22.94 58.83,22.94 64.47,17.3 102.95,17.3 104.09,16.15 112.39,16.15 v112.78,16.54 | 58.67,22.94 57.3,22.94 MAR_IN.K | v51.59,43.51 51.59,30.86 57.23,25.22 58.37,25.22 58.67,24.92 58.67,22.94
DATAB12  (via drill 0.35)
  Top 0.152: v39.47,121.23 40.62,121.23 BANKB.39 | v67.21,16.08 65.99,16.08 63.55,18.52 57.23,18.52 52.81,22.94 50.29,22.94 PC_IN.K 50.22,23.01 45.26,27.96 14.78,27.96 8.31,34.44 v7.62,34.44 | v99.14,11.43 99.75,11.43 104.55,16.23 v104.55,17.07
  Route2 0.152: v64.69,120.55 80.16,120.55 v86.41,126.8
  Route15 0.152: v32.69,114.45 v39.47,121.23
  Bottom 0.152: v39.47,121.23 45.49,121.23 46.79,119.94 64.08,119.94 v64.69,120.55 | v86.41,126.8 86.79,126.8 87.02,126.57 92.35,126.57 93.5,127.71 93.88,127.71 BB_HIGH.10 | v67.21,16.08 68.96,16.08 69.27,15.77 70.64,15.77 71.17,16.31 82.07,16.31 85.19,13.18 85.19,12.95 86.72,11.43 v99.14,11.43 | v104.55,17.07 111.71,17.07 115.67,21.03 118.8,21.03 120.47,22.71 PC_MAR_IR_IN.3 | v32.69,114.45 32.69,106.91 23.7,97.92 23.7,84.73 17.6,78.64 17.6,68.28 7.62,58.29 v7.62,34.44
DATAB13  (via drill 0.35)
  Top 0.152: v45.95,122.15 45.87,122.22 40.69,122.22 BANKB.41 | v69.57,16.38 69.27,16.69 65.84,16.69 63.48,19.05 59.28,19.05 56.31,22.02 56.31,24 57.53,25.22 58.14,25.22 63.25,30.33 63.25,34.98 STACK_IN.K | v116.97,11.73 118.64,11.73 121.23,14.33 121.23,19.51 124.44,22.71 RAM_STACK_IN.1
  Route2 0.152: v63.7,123.37 64.31,123.98 82.68,123.98 86.11,127.41 87.1,127.41 v87.33,127.18 | v42.9,88.39 42.9,86.64 48.84,80.7 48.84,64.62 43.51,59.28 43.51,50.6 46.18,47.93 48.08,47.93 53.03,42.98 55.32,42.98 63.25,35.05 STACK_IN.K
  Bottom 0.152: v63.7,123.37 62.48,122.15 v45.95,122.15 43.28,122.15 39.47,125.96 38.25,125.96 37.95,125.65 37.95,113 40.46,110.49 40.77,110.49 41.15,110.11 41.15,90.14 v42.9,88.39 | v87.33,127.18 91.67,127.18 93.42,128.93 93.88,128.93 BB_HIGH.11 | v69.57,16.38 70.79,16.38 71.02,16.61 93.27,16.61 96.77,13.11 96.77,12.88 97.61,12.04 116.66,12.04 v116.97,11.73
DATAB14  (via drill 0.35)
  Top 0.152: v56.77,123.37 55.02,123.37 | 55.02,123.37 46.33,123.37 46.25,123.29 40.69,123.29 BANKB.43 | v57.61,91.59 57.61,95.02 50.9,101.73 50.9,110.26 55.02,114.38 55.02,123.37
  Route2 0.152: v56.77,123.37 59.44,123.37 60.66,122.15 v68.66,122.15 | v77.34,30.4 58.6,30.4 55.78,33.22 52.05,33.22 50.29,34.98 RAM_IN_L.K
  Bottom 0.152: v68.66,122.15 74.91,122.15 80.77,128.02 91.21,128.02 93.42,130.23 93.88,130.23 BB_HIGH.12 | v57.61,91.59 57.61,69.04 52.05,63.48 52.05,55.09 46.48,49.53 46.48,42.75 50.22,39.01 50.22,35.05 RAM_IN_L.K | v77.34,30.4 83.36,24.38 84.96,24.38 85.5,23.85 85.5,20.57 86.26,19.81 88.54,19.81 88.92,20.19 111.1,20.19 112.78,21.87 112.78,22.1 115.06,24.38 124.89,24.38 126.49,22.78 126.95,22.78 RAM_STACK_IN.2
DATAB15  (via drill 0.35)
  Top 0.152: v56.54,126.26 55.47,126.26 53.49,124.28 40.69,124.28 BANKB.45 | v60.81,26.52 60.81,24.84 62.33,23.32 62.33,21.95 65.76,18.52 68.66,18.52 v71.48,15.7 | v129.08,15.93 129.08,22.25 129.54,22.71 RAM_STACK_IN.3
  Route2 0.152: v56.54,126.26 63.55,126.26 65,127.71 v79.55,127.71
  Route15 0.152: v79.55,127.71 79.55,119.25 75.74,115.44 75.74,77.5 65.76,67.51 65.68,67.51 57.68,59.51 57.68,48.69 53.11,44.12 53.11,38.18 56.24,35.05 RAM_IN_H.K
  Bottom 0.152: v79.55,127.71 80.01,127.71 80.62,128.32 90.3,128.32 93.5,131.52 93.88,131.52 BB_HIGH.13 | v60.81,26.52 59.44,26.52 58.83,27.13 58.83,27.28 56.31,29.79 56.31,34.98 RAM_IN_H.K | v71.48,15.7 74.68,15.7 76.5,13.87 76.5,12.57 77.42,11.66 85.57,11.66 86.72,10.52 125.88,10.52 128.85,13.49 128.85,15.7 v129.08,15.93
DATAB_SHIFT  (via drill 0.35)
  Top 0.152: v107.97,109.27 107.97,108.81 103.25,104.09 100.13,104.09 v92.89,96.85
  Route15 0.152: v63.17,90.98 62.71,90.98 57.91,86.18 7.09,86.18 6.1,85.19 4.72,85.19 JP3.4
  Bottom 0.152: BB_LOW.1 100.05,117.81 100.05,116.59 BB_LOW.2 100.13,116.51 100.74,116.51 v107.97,109.27 | v92.89,96.85 74.22,96.85 68.35,90.98 v63.17,90.98
DATAC0  (via drill 0.35)
  Top 0.152: v42.9,97.08 42.75,97.23 40.69,97.23 BANKC.29 | v91.29,102.49 91.29,102.95 97.31,108.97 105.39,108.97 106.91,110.49 114,110.49 v114.3,110.19 | v134.95,111.48 138.68,115.21 139.9,115.21 BC_LOW.3 139.98,115.29 140.59,115.9 148.59,115.9 149.5,114.99 149.5,110.72 149.88,110.34 150.5,110.34 152.51,112.36 | 152.51,112.36 157.58,117.42 158.88,117.42 IC23.1 | 152.51,112.36 v161.16,103.71
  Route15 0.152: v42.9,97.08 47.09,97.08 48.01,97.99 60.05,97.99 64.54,102.49 v65.84,102.49
  Bottom 0.152: v91.29,102.49 v65.84,102.49 | v114.3,110.19 133.66,110.19 v134.95,111.48 | v161.16,103.71 164.21,103.71 165.43,102.49 166.04,102.49 IC1.1
DATAC1  (via drill 0.35)
  Top 0.152: v45.95,95.86 43.59,98.22 40.69,98.22 BANKC.31 | v134.95,110.57 136.47,112.09 136.47,112.47 138,114 139.9,114 BC_LOW.4 | v154.08,113 157.2,116.13 158.88,116.13 IC23.2
  Route2 0.152: v120.09,98.15 120.24,98.15 132.66,110.57 v134.95,110.57
  Route15 0.152: v45.95,95.86 49,95.86 50.44,97.31 62.71,97.31 v63.48,98.07 | v134.95,110.57 137.39,113 v154.08,113 154.08,112.01 v163.91,102.18
  Bottom 0.152: v63.48,98.07 66.37,98.07 67.06,98.75 71.55,98.75 73.3,100.51 104.09,100.51 105.69,98.91 119.33,98.91 v120.09,98.15 | v163.91,102.18 164.9,101.19 166.04,101.19 IC1.2
DATAC2  (via drill 0.35)
  Top 0.152: v160.48,114.38 160.02,114.83 158.95,114.83 IC23.3 158.88,114.83 156.82,114.83 154.31,112.32 v153.47,112.32 | v39.47,99.21 40.62,99.21 BANKC.33 | v92.66,103.4 97.92,108.66 105.54,108.66 107.06,110.19 110.41,110.19 v110.72,109.88 | v137.47,112.09 139.29,112.09 139.9,112.7 BC_LOW.5
  Route15 0.152: v39.47,99.21 41.83,99.21 42.06,98.98 47.7,98.98 52.12,103.4 v69.65,103.4 | v153.47,112.32 147.45,112.32 147.37,112.39 137.77,112.39 v137.47,112.09